# Altium project CHESSOBC_rev1.PrjPcb (part 1 of 2)
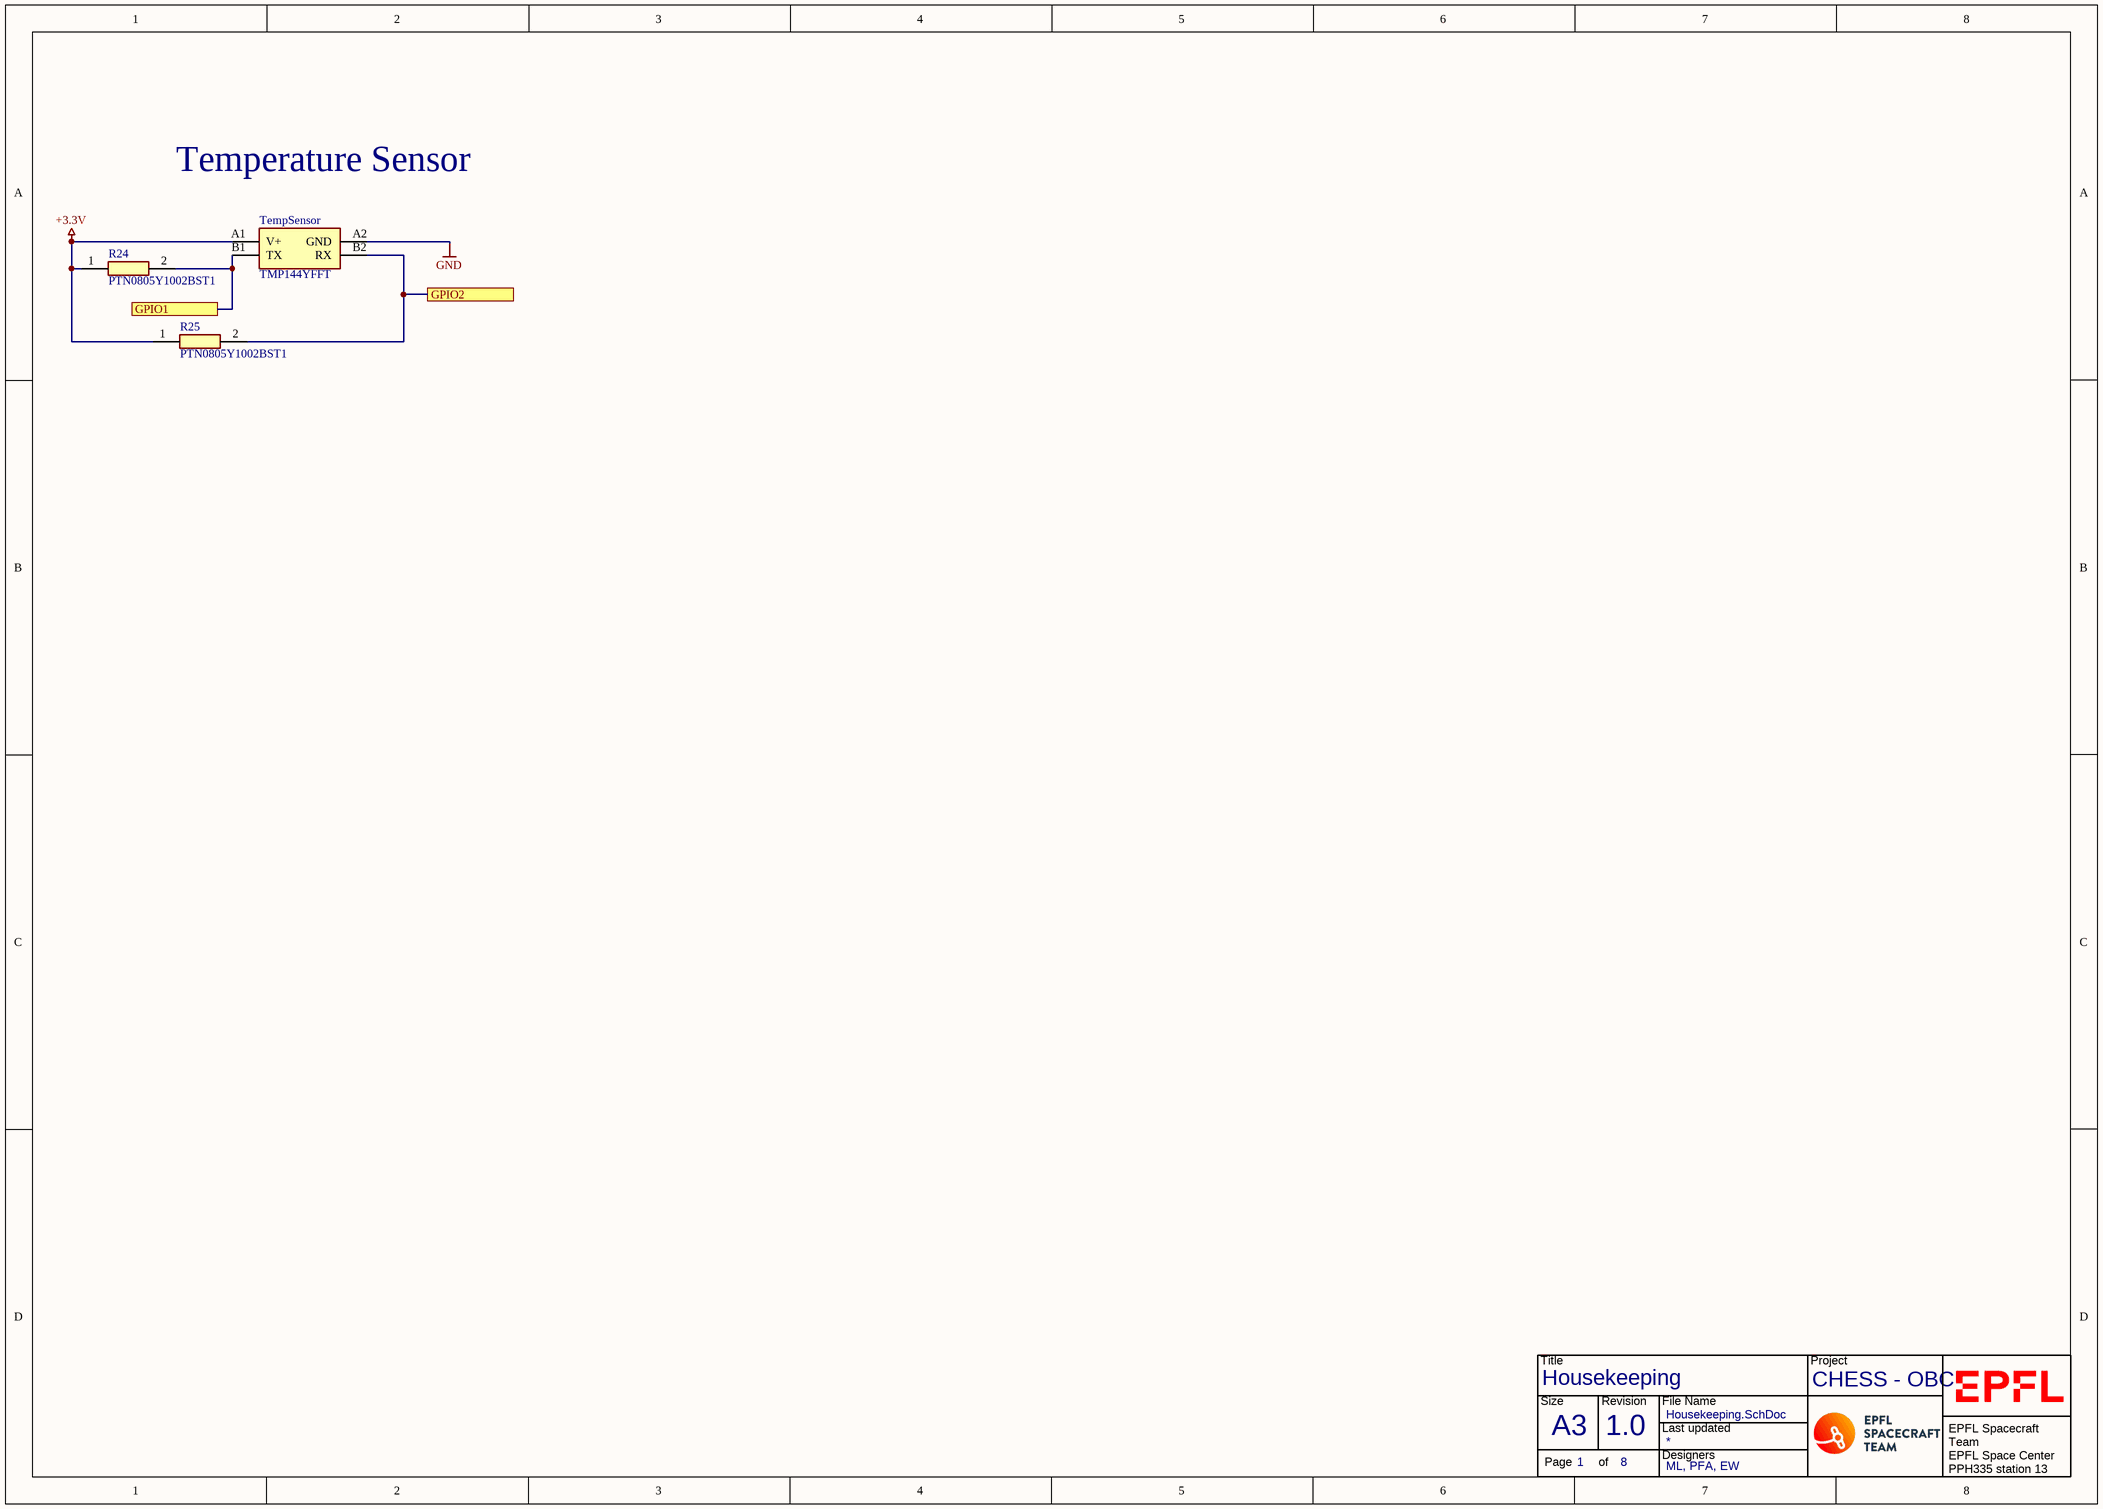
[diagram p0: Housekeeping.SchDoc]
Designers: ML, PFA, EW; Project: CHESS - OBC
8 sheets, 154 parts. Net scope: flat (ports and power ports of the same name join across sheets).
Board file: CHESSOBC_rev1.PcbDoc
Sheets:
  Housekeeping.SchDoc
  Memory.SchDoc
  Interface.SchDoc
  Power.SchDoc
  FPGAPower.SchDoc
  FPGABanks.SchDoc
  FPGAMisc.SchDoc
  GPIO_Headers.SchDoc

## Sheet Housekeeping.SchDoc: Housekeeping
size A3; PageSetup: Record=PageOptions|CenterHorizontal=True|CenterVertical=True|PrintScale=1.00|XCorrection=1.00|YCorrection=1.00|PrintKind=1|BorderSize=5000000|LeftOffset=0|BottomOffset=0|Orientation=2|PaperLength=1000|PaperWidth=1000|Scale=100|PaperSource=15|PrintQuality=1200|MediaType=1|DitherType=10|PrintScaleMode=1|PaperKind=A4|PaperIndex=9; Organization: Altium Limited; Address1: L3, 12a Rodborough Rd; Address2: Frenchs Forest; Address3: NSW; Address4: Australia 2086; DocumentNumber: 1; Revision: 1.0; SheetNumber: 1; SheetTotal: 8; SheetSize: A3

### Parts
(Parts that share a designator on the sheet are numbered #1, #2 ... from top to bottom, then left to right.)
*#1  TitleBlock  (value not drawn)  (graphical)
R24  PTN0805Y1002BST1  [RESC2013X84N]
R25  PTN0805Y1002BST1  [RESC2013X84N]
TempSensor  TMP144YFFT  [TMP144YFFT]

### Ports
GPIO1, GPIO2

### Nets
+3.3V: R24.1 R25.1 TempSensor.A1(V+)
GND: TempSensor.A2(GND)
NetP_GPIO_1: R24.2 TempSensor.B1(TX) ; port GPIO1
NetP_GPIO_2: R25.2 TempSensor.B2(RX) ; port GPIO2

### Notes on the sheet
- Temperature Sensor
- Title
- Size:
- Date:
- A3
- Number:
- Time:
- Revision:
- Sheet
- of
- File:
- (in symbol TitleBlock) Title; Project; Size; Revision; File Name; Last updated; Designers; Page; of; EPFL Spacecraft Team / EPFL Space Center / PPH335 station 13 / CH-1015 Lausanne

### Library data of the parts
*#1 = TitleBlock: Title Block with generall information
R24 R25 = PTN0805Y1002BST1: Resistor; Manufacturer_Name: Vishay; Datasheet Link: https://www.mouser.co.uk/datasheet/2/427/ptn-1763593.pdf; Height: 0.838mm; Manufacturer_Part_Number: PTN0805Y1002BST1
TempSensor = TMP144YFFT: Integrated Circuit; Manufacturer_Name: Texas Instruments; Datasheet Link: http://www.ti.com/lit/ds/symlink/tmp144.pdf; Height: 0.625mm; Manufacturer_Part_Number: TMP144YFFT

## Sheet Memory.SchDoc: Core
size A3; PageSetup: Record=PageOptions|CenterHorizontal=True|CenterVertical=True|PrintScale=1.00|XCorrection=1.00|YCorrection=1.00|PrintKind=1|BorderSize=5000000|LeftOffset=0|BottomOffset=0|Orientation=2|PaperLength=1000|PaperWidth=1000|Scale=100|PaperSource=15|PrintQuality=1200|MediaType=1|DitherType=10|PrintScaleMode=1|PaperKind=A4|PaperIndex=9; Organization: Altium Limited; Address1: L3, 12a Rodborough Rd; Address2: Frenchs Forest; Address3: NSW; Address4: Australia 2086; DocumentNumber: 2; Revision: 1.0; SheetNumber: 2; SheetTotal: 8; SheetSize: A3
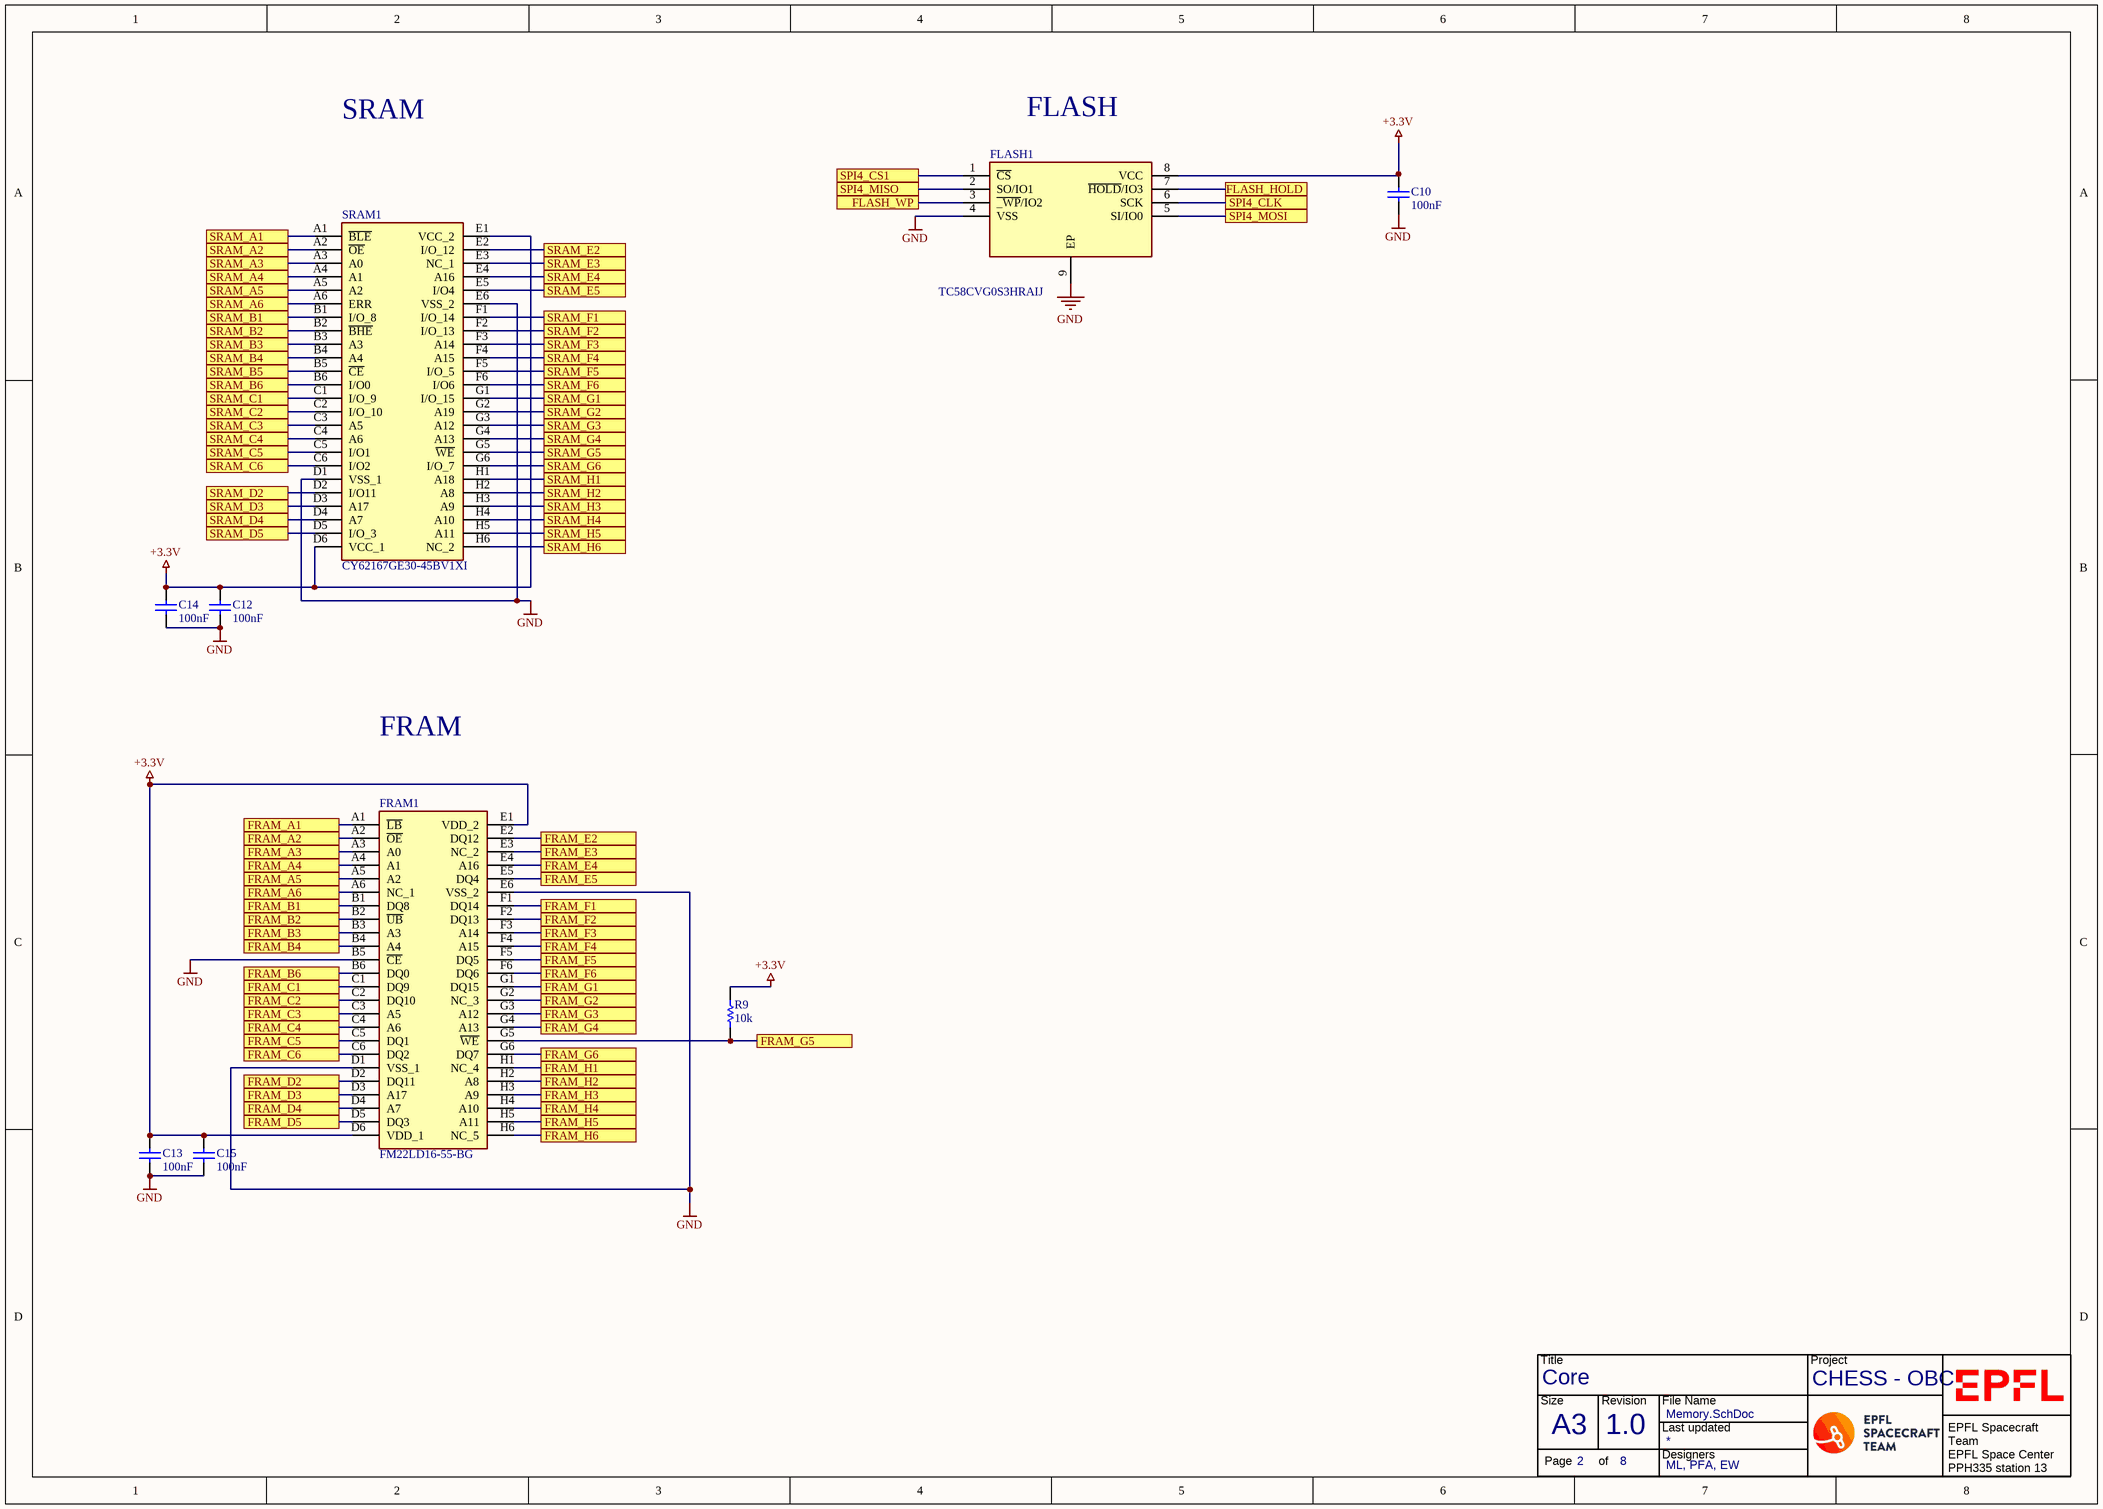
[diagram p1: Memory.SchDoc]

### Parts
(Parts that share a designator on the sheet are numbered #1, #2 ... from top to bottom, then left to right.)
*#2  TitleBlock  (value not drawn)  (graphical)
C10  100nF  [CAPC1005X60X30ML05T10]
C12  100nF  [CAPC1005X60X30ML05T10]
C13  100nF  [CAPC1005X60X30ML05T10]
C14  100nF  [CAPC1005X60X30ML05T10]
C15  100nF  [CAPC1005X60X30ML05T10]
FLASH1  TC58CVG0S3HRAIJ  [SON127P800X600X80-9N-D]
FRAM1  FM22LD16-55-BG  [BGA48C75P6X8_600X800X120]
R9  10k  [RESC1005X40X25LL05T10]
SRAM1  CY62167GE30-45BV1XI  [BGA48C75P6X8_600X800X100]

### Ports
FLASH_HOLD, FLASH_WP, FRAM_A1, FRAM_A2, FRAM_A3, FRAM_A4, FRAM_A5, FRAM_A6, FRAM_B1, FRAM_B2, FRAM_B3, FRAM_B4, FRAM_B6, FRAM_C1, FRAM_C2, FRAM_C3, FRAM_C4, FRAM_C5, FRAM_C6, FRAM_D2, FRAM_D3, FRAM_D4, FRAM_D5, FRAM_E2, FRAM_E3, FRAM_E4, FRAM_E5, FRAM_F1, FRAM_F2, FRAM_F3, FRAM_F4, FRAM_F5, FRAM_F6, FRAM_G1, FRAM_G2, FRAM_G3, FRAM_G4, FRAM_G5, FRAM_G6, FRAM_H1, FRAM_H2, FRAM_H3, FRAM_H4, FRAM_H5, FRAM_H6, SPI4_CLK, SPI4_CS1, SPI4_MISO, SPI4_MOSI, SRAM_A1, SRAM_A2, SRAM_A3, SRAM_A4, SRAM_A5, SRAM_A6, SRAM_B1, SRAM_B2, SRAM_B3, SRAM_B4, SRAM_B5, SRAM_B6, SRAM_C1, SRAM_C2, SRAM_C3, SRAM_C4, SRAM_C5, SRAM_C6, SRAM_D2, SRAM_D3, SRAM_D4, SRAM_D5, SRAM_E2, SRAM_E3, SRAM_E4, SRAM_E5, SRAM_F1, SRAM_F2, SRAM_F3, SRAM_F4, SRAM_F5, SRAM_F6, SRAM_G1, SRAM_G2, SRAM_G3, SRAM_G4, SRAM_G5, SRAM_G6, SRAM_H1, SRAM_H2, SRAM_H3, SRAM_H4, SRAM_H5, SRAM_H6

### Nets
+3.3V: C10.2 C12.2 C13.2 C14.2 C15.2 FLASH1.8(VCC) FRAM1.D6(VDD_1) FRAM1.E1(VDD_2) R9.2 SRAM1.D6(VCC_1) SRAM1.E1(VCC_2)
GND: C10.1 C12.1 C13.1 C14.1 C15.1 FLASH1.4(VSS) FLASH1.9(EP) FRAM1.B5(~{CE}) FRAM1.D1(VSS_1) FRAM1.E6(VSS_2) SRAM1.D1(VSS_1) SRAM1.E6(VSS_2)
NetCOM_Header_14: FLASH1.6(SCK) ; port SPI4_CLK
NetFLASH1_1: FLASH1.1(~{CS}) ; port SPI4_CS1
NetFLASH1_2: FLASH1.2(SO/IO1) ; port SPI4_MISO
NetFLASH1_3: FLASH1.3(~{_WP}/IO2) ; port FLASH_WP
NetFLASH1_5: FLASH1.5(SI/IO0) ; port SPI4_MOSI
NetFLASH1_7: FLASH1.7(~{HOLD}/IO3) ; port FLASH_HOLD
NetFRAM1_A1: FRAM1.A1(~{LB}) ; port FRAM_A1
NetFRAM1_A2: FRAM1.A2(~{OE}) ; port FRAM_A2
NetFRAM1_A3: FRAM1.A3(A0) ; port FRAM_A3
NetFRAM1_A4: FRAM1.A4(A1) ; port FRAM_A4
NetFRAM1_A5: FRAM1.A5(A2) ; port FRAM_A5
NetFRAM1_A6: FRAM1.A6(NC_1) ; port FRAM_A6
NetFRAM1_B1: FRAM1.B1(DQ8) ; port FRAM_B1
NetFRAM1_B2: FRAM1.B2(~{UB}) ; port FRAM_B2
NetFRAM1_B3: FRAM1.B3(A3) ; port FRAM_B3
NetFRAM1_B4: FRAM1.B4(A4) ; port FRAM_B4
NetFRAM1_B6: FRAM1.B6(DQ0) ; port FRAM_B6
NetFRAM1_C1: FRAM1.C1(DQ9) ; port FRAM_C1
NetFRAM1_C2: FRAM1.C2(DQ10) ; port FRAM_C2
NetFRAM1_C3: FRAM1.C3(A5) ; port FRAM_C3
NetFRAM1_C4: FRAM1.C4(A6) ; port FRAM_C4
NetFRAM1_C5: FRAM1.C5(DQ1) ; port FRAM_C5
NetFRAM1_C6: FRAM1.C6(DQ2) ; port FRAM_C6
NetFRAM1_D2: FRAM1.D2(DQ11) ; port FRAM_D2
NetFRAM1_D3: FRAM1.D3(A17) ; port FRAM_D3
NetFRAM1_D4: FRAM1.D4(A7) ; port FRAM_D4
NetFRAM1_D5: FRAM1.D5(DQ3) ; port FRAM_D5
NetFRAM1_E2: FRAM1.E2(DQ12) ; port FRAM_E2
NetFRAM1_E3: FRAM1.E3(NC_2) ; port FRAM_E3
NetFRAM1_E4: FRAM1.E4(A16) ; port FRAM_E4
NetFRAM1_E5: FRAM1.E5(DQ4) ; port FRAM_E5
NetFRAM1_F1: FRAM1.F1(DQ14) ; port FRAM_F1
NetFRAM1_F2: FRAM1.F2(DQ13) ; port FRAM_F2
NetFRAM1_F3: FRAM1.F3(A14) ; port FRAM_F3
NetFRAM1_F4: FRAM1.F4(A15) ; port FRAM_F4
NetFRAM1_F5: FRAM1.F5(DQ5) ; port FRAM_F5
NetFRAM1_F6: FRAM1.F6(DQ6) ; port FRAM_F6
NetFRAM1_G1: FRAM1.G1(DQ15) ; port FRAM_G1
NetFRAM1_G2: FRAM1.G2(NC_3) ; port FRAM_G2
NetFRAM1_G3: FRAM1.G3(A12) ; port FRAM_G3
NetFRAM1_G4: FRAM1.G4(A13) ; port FRAM_G4
NetFRAM1_G5: FRAM1.G5(~{WE}) R9.1 ; port FRAM_G5
NetFRAM1_G6: FRAM1.G6(DQ7) ; port FRAM_G6
NetFRAM1_H1: FRAM1.H1(NC_4) ; port FRAM_H1
NetFRAM1_H2: FRAM1.H2(A8) ; port FRAM_H2
NetFRAM1_H3: FRAM1.H3(A9) ; port FRAM_H3
NetFRAM1_H4: FRAM1.H4(A10) ; port FRAM_H4
NetFRAM1_H5: FRAM1.H5(A11) ; port FRAM_H5
NetFRAM1_H6: FRAM1.H6(NC_5) ; port FRAM_H6
NetSRAM1_A1: SRAM1.A1(~{BLE}) ; port SRAM_A1
NetSRAM1_A2: SRAM1.A2(~{OE}) ; port SRAM_A2
NetSRAM1_A3: SRAM1.A3(A0) ; port SRAM_A3
NetSRAM1_A4: SRAM1.A4(A1) ; port SRAM_A4
NetSRAM1_A5: SRAM1.A5(A2) ; port SRAM_A5
NetSRAM1_A6: SRAM1.A6(ERR) ; port SRAM_A6
NetSRAM1_B1: SRAM1.B1(I/O_8) ; port SRAM_B1
NetSRAM1_B2: SRAM1.B2(~{BHE}) ; port SRAM_B2
NetSRAM1_B3: SRAM1.B3(A3) ; port SRAM_B3
NetSRAM1_B4: SRAM1.B4(A4) ; port SRAM_B4
NetSRAM1_B5: SRAM1.B5(~{CE}) ; port SRAM_B5
NetSRAM1_B6: SRAM1.B6(I/O0) ; port SRAM_B6
NetSRAM1_C1: SRAM1.C1(I/O_9) ; port SRAM_C1
NetSRAM1_C2: SRAM1.C2(I/O_10) ; port SRAM_C2
NetSRAM1_C3: SRAM1.C3(A5) ; port SRAM_C3
NetSRAM1_C4: SRAM1.C4(A6) ; port SRAM_C4
NetSRAM1_C5: SRAM1.C5(I/O1) ; port SRAM_C5
NetSRAM1_C6: SRAM1.C6(I/O2) ; port SRAM_C6
NetSRAM1_D2: SRAM1.D2(I/O11) ; port SRAM_D2
NetSRAM1_D3: SRAM1.D3(A17) ; port SRAM_D3
NetSRAM1_D4: SRAM1.D4(A7) ; port SRAM_D4
NetSRAM1_D5: SRAM1.D5(I/O_3) ; port SRAM_D5
NetSRAM1_E2: SRAM1.E2(I/O_12) ; port SRAM_E2
NetSRAM1_E3: SRAM1.E3(NC_1) ; port SRAM_E3
NetSRAM1_E4: SRAM1.E4(A16) ; port SRAM_E4
NetSRAM1_E5: SRAM1.E5(I/O4) ; port SRAM_E5
NetSRAM1_F1: SRAM1.F1(I/O_14) ; port SRAM_F1
NetSRAM1_F2: SRAM1.F2(I/O_13) ; port SRAM_F2
NetSRAM1_F3: SRAM1.F3(A14) ; port SRAM_F3
NetSRAM1_F4: SRAM1.F4(A15) ; port SRAM_F4
NetSRAM1_F5: SRAM1.F5(I/O_5) ; port SRAM_F5
NetSRAM1_F6: SRAM1.F6(I/O6) ; port SRAM_F6
NetSRAM1_G1: SRAM1.G1(I/O_15) ; port SRAM_G1
NetSRAM1_G2: SRAM1.G2(A19) ; port SRAM_G2
NetSRAM1_G3: SRAM1.G3(A12) ; port SRAM_G3
NetSRAM1_G4: SRAM1.G4(A13) ; port SRAM_G4
NetSRAM1_G5: SRAM1.G5(~{WE}) ; port SRAM_G5
NetSRAM1_G6: SRAM1.G6(I/O_7) ; port SRAM_G6
NetSRAM1_H1: SRAM1.H1(A18) ; port SRAM_H1
NetSRAM1_H2: SRAM1.H2(A8) ; port SRAM_H2
NetSRAM1_H3: SRAM1.H3(A9) ; port SRAM_H3
NetSRAM1_H4: SRAM1.H4(A10) ; port SRAM_H4
NetSRAM1_H5: SRAM1.H5(A11) ; port SRAM_H5
NetSRAM1_H6: SRAM1.H6(NC_2) ; port SRAM_H6

### Notes on the sheet
- SRAM
- (near FLASH1) FLASH
- FRAM
- Title
- Size:
- Date:
- A3
- Number:
- Time:
- Revision:
- Sheet
- of
- File:
- (in symbol TitleBlock) Title; Project; Size; Revision; File Name; Last updated; Designers; Page; of; EPFL Spacecraft Team / EPFL Space Center / PPH335 station 13 / CH-1015 Lausanne

### Library data of the parts
*#2 = TitleBlock: Title Block with generall information
C10 C12-C15 = CMP-2008-02046-1: Manufacturer: Kemet; Part Number: C0402C104K8PACTU
FLASH1 = TC58CVG0S3HRAIJ: Capacitor Polarised; Manufacturer_Name: Kioxia America; Datasheet Link: https://business.kioxia.com/en-us/memory/detail.TC58CVG0S3HRAIJ.html; Height: 0.8mm; Manufacturer_Part_Number: TC58CVG0S3HRAIJ; Mouser Part Number: 757-TC58CVG0S3HRAIJ; Mouser Price/Stock: https://www.mouser.co.uk/ProductDetail/Kioxia-America/TC58CVG0S3HRAIJ?qs=OlC7AqGiEDnRG%2Fk7X5l76A%3D%3D
FRAM1 = FM22LD16-55-BG: Integrated Circuit; Manufacturer_Name: Cypress Semiconductor; Datasheet Link: https://datasheet.datasheetarchive.com/originals/dk/DKDS-12/237922.pdf; Height: 1.2mm; Manufacturer_Part_Number: FM22LD16-55-BG; Mouser Part Number: 877-FM22LD16-55-BG; Mouser Price/Stock: https://www.mouser.com/Search/Refine.aspx?Keyword=877-FM22LD16-55-BG; Arrow Part Number: FM22LD16-55-BG; Arrow Price/Stock: https://www.arrow.com/en/products/fm22ld16-55-bg/cypress-semiconductor
R9 = CMP-2002-07353-1: Part Number: RC0402FR-0710KL; Manufacturer: Yageo / Phycomp
SRAM1 = CY62167GE30-45BV1XI: Integrated Circuit; Manufacturer_Name: Cypress Semiconductor; Datasheet Link: https://datasheet.datasheetarchive.com/originals/dk/DKDS-12/238198.pdf; Height: 1mm; Manufacturer_Part_Number: CY62167GE30-45BV1XI; Mouser Part Number: 727-CY62167GE30BV1XI; Mouser Price/Stock: https://www.mouser.co.uk/ProductDetail/Cypress-Semiconductor/CY62167GE30-45BV1XI/?qs=3FnuM6ZipRIEqfAGSsiEJg%3D%3D; Arrow Part Number: CY62167GE30-45BV1XI; Arrow Price/Stock: https://www.arrow.com/en/products/cy62167ge30-45bv1xi/cypress-semiconductor

## Sheet Interface.SchDoc: Interface
size A3; PageSetup: Record=PageOptions|CenterHorizontal=True|CenterVertical=True|PrintScale=1.00|XCorrection=1.00|YCorrection=1.00|PrintKind=1|BorderSize=5000000|LeftOffset=0|BottomOffset=0|Orientation=2|PaperLength=1000|PaperWidth=1000|Scale=100|PaperSource=15|PrintQuality=1200|MediaType=1|DitherType=10|PrintScaleMode=1|PaperKind=A4|PaperIndex=9; Organization: Altium Limited; Address1: L3, 12a Rodborough Rd; Address2: Frenchs Forest; Address3: NSW; Address4: Australia 2086; DocumentNumber: 3; Revision: 1.0; SheetNumber: 3; SheetTotal: 8; SheetSize: A3
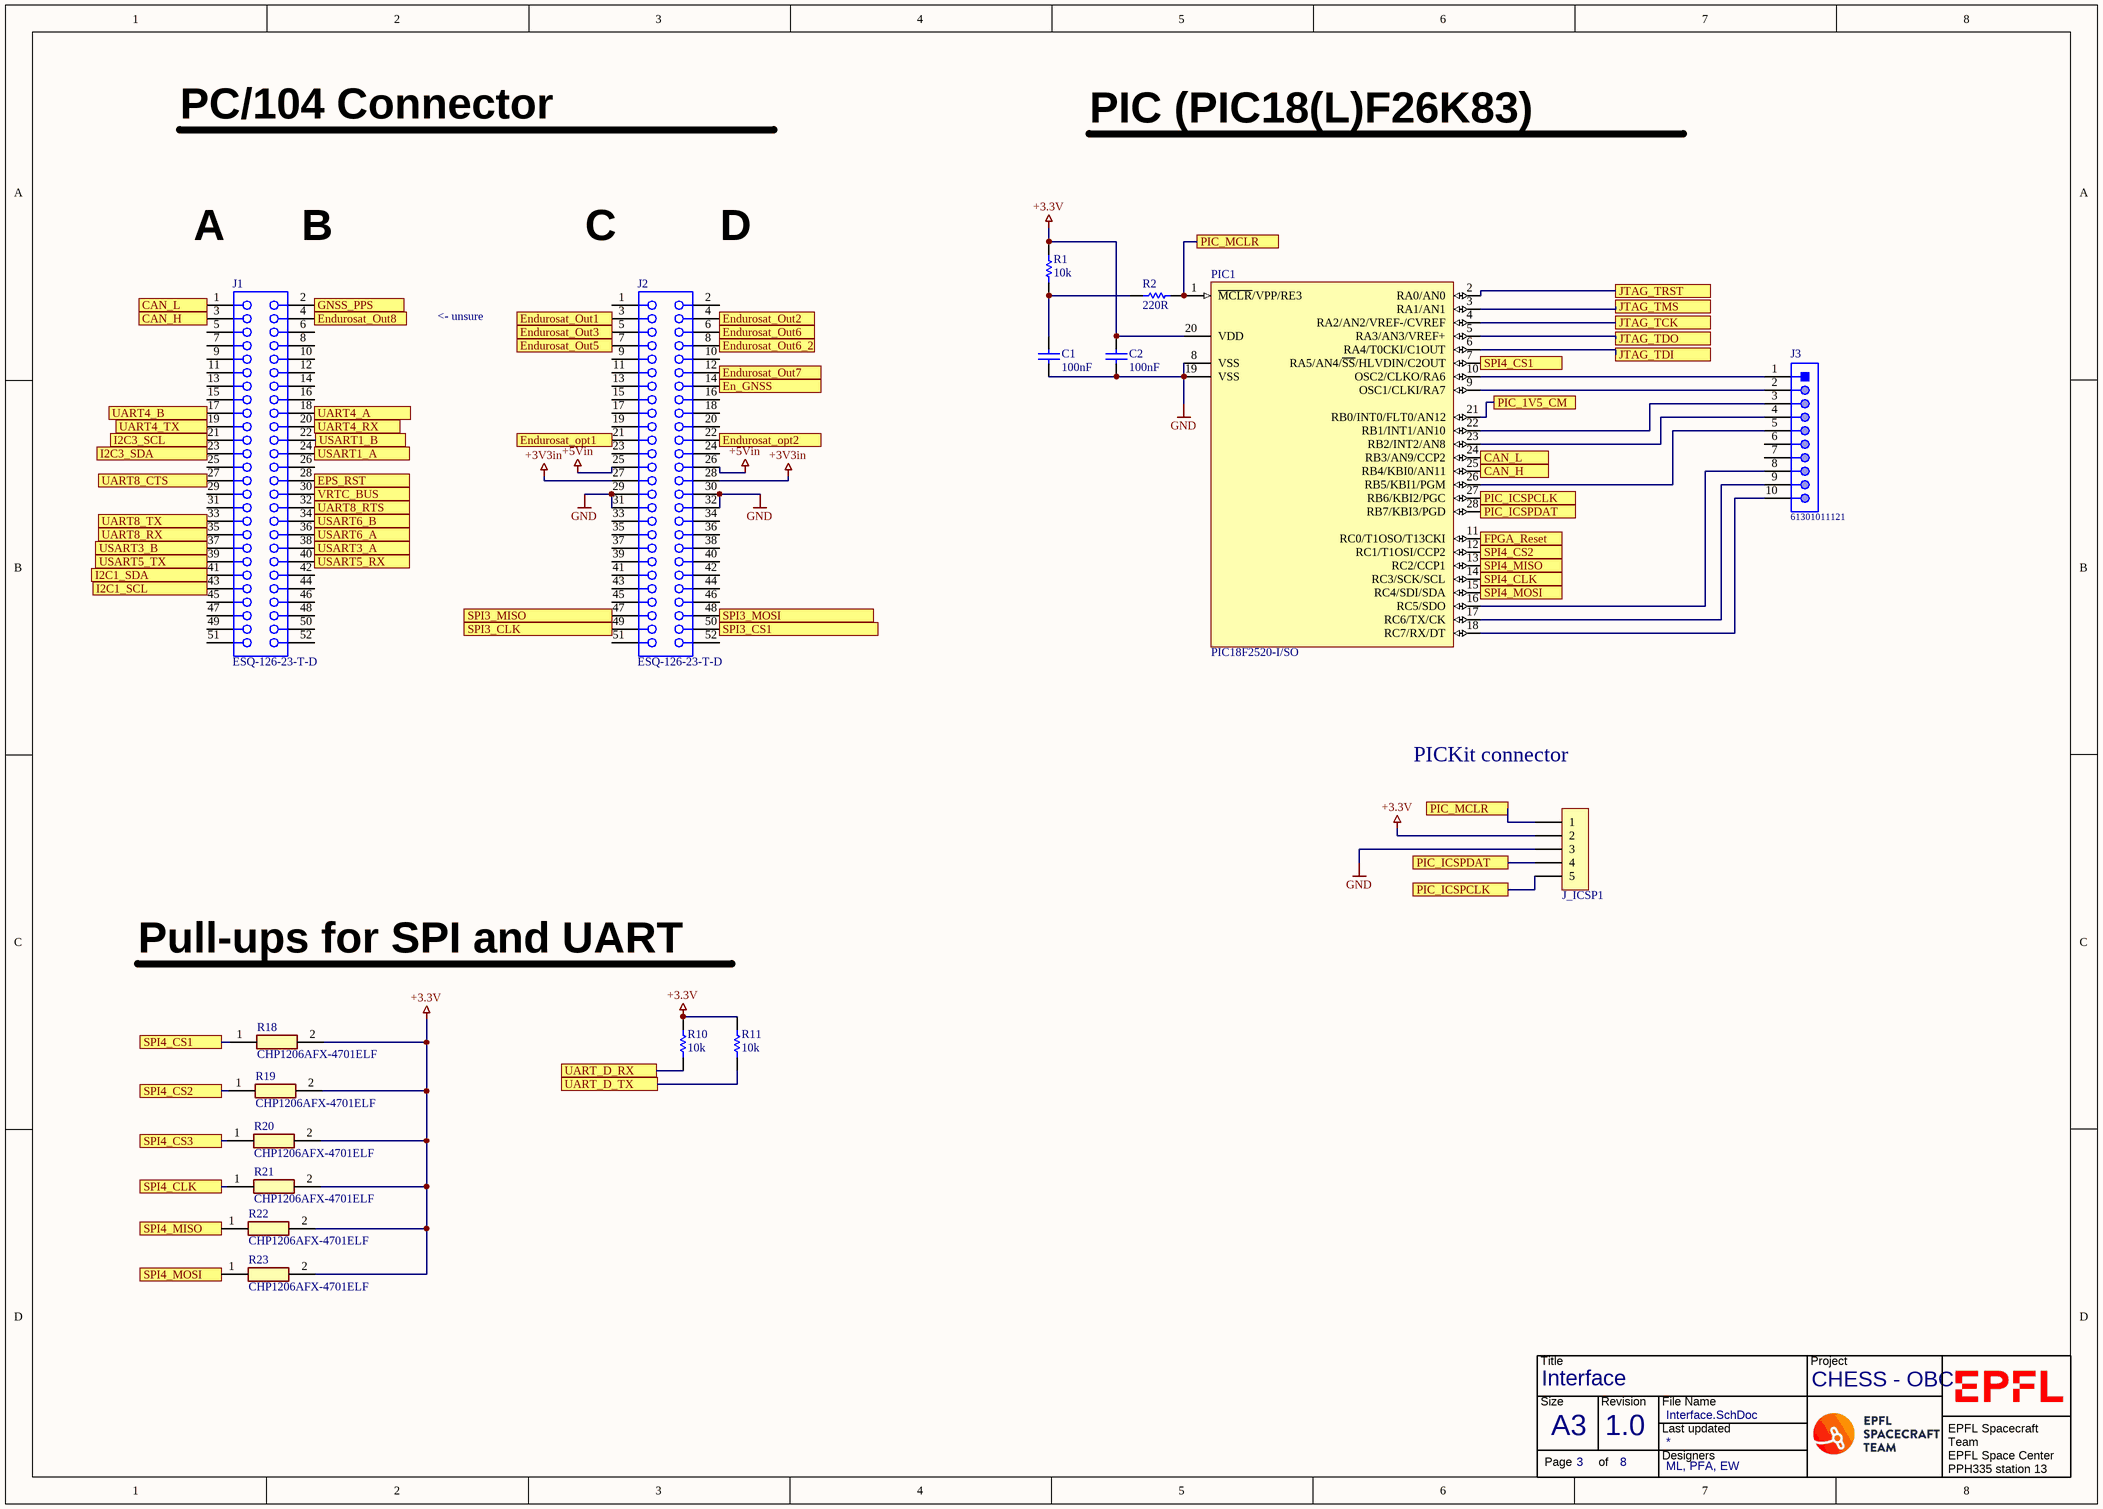
[diagram p2: Interface.SchDoc]

### Parts
(Parts that share a designator on the sheet are numbered #1, #2 ... from top to bottom, then left to right.)
*#3  TitleBlock  (value not drawn)  (graphical)
C1  100nF  [CAPC1005X60X30ML05T10]
C2  100nF  [CAPC1005X60X30ML05T10]
J1  ESQ-126-23-T-D  [SMTC-ESQ-126-23-X-D]
J2  ESQ-126-23-T-D  [SMTC-ESQ-126-23-X-D]
J3  61301011121  [61301011121]
J_ICSP1  *  [HDR1X5]  (value not drawn)
PIC1  PIC18F2520-I/SO  [SOIC-SO28_L]
R1  10k  [RESC1005X40X25LL05T10]
R2  220R  [RESC1005X40X25ML05T10]
R10  10k  [RESC1005X40X25LL05T10]
R11  10k  [RESC1005X40X25LL05T10]
R18  CHP1206AFX-4701ELF  [RESC3116X65N]
R19  CHP1206AFX-4701ELF  [RESC3116X65N]
R20  CHP1206AFX-4701ELF  [RESC3116X65N]
R21  CHP1206AFX-4701ELF  [RESC3116X65N]
R22  CHP1206AFX-4701ELF  [RESC3116X65N]
R23  CHP1206AFX-4701ELF  [RESC3116X65N]

### Ports
CAN_H, CAN_L, En_GNSS, Endurosat_opt1, Endurosat_opt2, Endurosat_Out1, Endurosat_Out2, Endurosat_Out3, Endurosat_Out5, Endurosat_Out6, Endurosat_Out6_2, Endurosat_Out7, Endurosat_Out8, EPS_RST, FPGA_Reset, GNSS_PPS, I2C1_SCL, I2C1_SDA, I2C3_SCL, I2C3_SDA, JTAG_TCK, JTAG_TDI, JTAG_TDO, JTAG_TMS, JTAG_TRST, PIC_1V5_CM, PIC_ICSPCLK, PIC_ICSPDAT, PIC_MCLR, SPI3_CLK, SPI3_CS1, SPI3_MISO, SPI3_MOSI, SPI4_CLK, SPI4_CS1, SPI4_CS2, SPI4_CS3, SPI4_MISO, SPI4_MOSI, UART4_A, UART4_B, UART4_RX, UART4_TX, UART8_CTS, UART8_RTS, UART8_RX, UART8_TX, UART_D_RX, UART_D_TX, USART1_A, USART1_B, USART3_A, USART3_B, USART5_RX, USART5_TX, USART6_A, USART6_B, VRTC_BUS

### Nets
+3.3V: C2.2 J2.27 J2.28 J_ICSP1.2 PIC1.20(VDD) R1.2 R10.2 R11.2 R18.2 R19.2 R20.2 R21.2 R22.2 R23.2  [also labelled +3V3in]
+5Vin: J2.25 J2.26
GND: C1.1 C2.1 J2.29 J2.30 J2.31 J2.32 J_ICSP1.3 PIC1.8(VSS) PIC1.19(VSS)
NetC1_2: C1.2 R1.1 R2.1
NetC58_2: PIC1.21(RB0/INT0/FLT0/AN12) ; port PIC_1V5_CM
NetCOM_Header_14: PIC1.14(RC3/SCK/SCL) R21.1 ; port SPI4_CLK
NetCOM_Header_16: R20.1 ; port SPI4_CS3
NetCOM_Header_19: R10.1 ; port UART_D_RX
NetCOM_Header_20: R11.1 ; port UART_D_TX
NetFLASH1_1: PIC1.7(RA5/AN4/~{SS}/HLVDIN/C2OUT) R18.1 ; port SPI4_CS1
NetFLASH1_2: PIC1.13(RC2/CCP1) R22.1 ; port SPI4_MISO
NetFLASH1_5: PIC1.15(RC4/SDI/SDA) R23.1 ; port SPI4_MOSI
NetJ1_1: J1.1 PIC1.24(RB3/AN9/CCP2) ; port CAN_L
NetJ1_2: J1.2 ; port GNSS_PPS
NetJ1_3: J1.3 PIC1.25(RB4/KBI0/AN11) ; port CAN_H
NetJ1_4: J1.4 ; port Endurosat_Out8
NetJ1_17: J1.17 ; port UART4_B
NetJ1_18: J1.18 ; port UART4_A
NetJ1_19: J1.19 ; port UART4_TX
NetJ1_20: J1.20 ; port UART4_RX
NetJ1_21: J1.21 ; port I2C3_SCL
NetJ1_22: J1.22 ; port USART1_B
NetJ1_23: J1.23 ; port I2C3_SDA
NetJ1_24: J1.24 ; port USART1_A
NetJ1_27: J1.27 ; port UART8_CTS
NetJ1_28: J1.28 ; port EPS_RST
NetJ1_30: J1.30 ; port VRTC_BUS
NetJ1_32: J1.32 ; port UART8_RTS
NetJ1_33: J1.33 ; port UART8_TX
NetJ1_34: J1.34 ; port USART6_B
NetJ1_35: J1.35 ; port UART8_RX
NetJ1_36: J1.36 ; port USART6_A
NetJ1_37: J1.37 ; port USART3_B
NetJ1_38: J1.38 ; port USART3_A
NetJ1_39: J1.39 ; port USART5_TX
NetJ1_40: J1.40 ; port USART5_RX
NetJ1_41: J1.41 ; port I2C1_SDA
NetJ1_43: J1.43 ; port I2C1_SCL
NetJ2_3: J2.3 ; port Endurosat_Out1
NetJ2_4: J2.4 ; port Endurosat_Out2
NetJ2_5: J2.5 ; port Endurosat_Out3
NetJ2_6: J2.6 ; port Endurosat_Out6
NetJ2_7: J2.7 ; port Endurosat_Out5
NetJ2_8: J2.8 ; port Endurosat_Out6_2
NetJ2_12: J2.12 ; port Endurosat_Out7
NetJ2_14: J2.14 ; port En_GNSS
NetJ2_21: J2.21 ; port Endurosat_opt1
NetJ2_22: J2.22 ; port Endurosat_opt2
NetJ2_47: J2.47 ; port SPI3_MISO
NetJ2_48: J2.48 ; port SPI3_MOSI
NetJ2_49: J2.49 ; port SPI3_CLK
NetJ2_50: J2.50 ; port SPI3_CS1
NetJ3_1: J3.1 PIC1.10(OSC2/CLKO/RA6)
NetJ3_2: J3.2 PIC1.9(OSC1/CLKI/RA7)
NetJ3_3: J3.3 PIC1.22(RB1/INT1/AN10)
NetJ3_4: J3.4 PIC1.23(RB2/INT2/AN8)
NetJ3_5: J3.5 PIC1.26(RB5/KBI1/PGM)
NetJ3_8: J3.8 PIC1.16(RC5/SDO)
NetJ3_9: J3.9 PIC1.17(RC6/TX/CK)
NetJ3_10: J3.10 PIC1.18(RC7/RX/DT)
NetJ_ICSP1_1: J_ICSP1.1 PIC1.1(~{MCLR}/VPP/RE3) R2.2 ; port PIC_MCLR
NetJ_ICSP1_4: J_ICSP1.4 PIC1.28(RB7/KBI3/PGD) ; port PIC_ICSPDAT
NetJ_ICSP1_5: J_ICSP1.5 PIC1.27(RB6/KBI2/PGC) ; port PIC_ICSPCLK
NetPIC1_2: PIC1.2(RA0/AN0) ; port JTAG_TRST
NetPIC1_3: PIC1.3(RA1/AN1) ; port JTAG_TMS
NetPIC1_4: PIC1.4(RA2/AN2/VREF-/CVREF) ; port JTAG_TCK
NetPIC1_5: PIC1.5(RA3/AN3/VREF+) ; port JTAG_TDO
NetPIC1_6: PIC1.6(RA4/T0CKI/C1OUT) ; port JTAG_TDI
NetPIC1_11: PIC1.11(RC0/T1OSO/T13CKI) ; port FPGA_Reset
NetPIC1_12: PIC1.12(RC1/T1OSI/CCP2) R19.1 ; port SPI4_CS2

Not connected (* = marked no-connect by the designer): J1 5 6 7 8 9 10 11 12 13 14 15 16 25 26 29 31 42 44 45 46 47 48 49 50 51 52; J2 1 2 9 10 11 13 15 16 17 18 19 20 23 24 33 34 35 36 37 38 39 40 41 42 43 44 45 46 51 52; J3 6 7

### Notes on the sheet
- PC/104 Connector
- PIC (PIC18(L)F26K83)
- A
- B
- C
- D
- <- unsure
- PICKit connector
- Pull-ups for SPI and UART
- Title
- Size:
- Date:
- A3
- Number:
- Time:
- Revision:
- Sheet
- of
- File:
- (in symbol TitleBlock) Title; Project; Size; Revision; File Name; Last updated; Designers; Page; of; EPFL Spacecraft Team / EPFL Space Center / PPH335 station 13 / CH-1015 Lausanne

### Library data of the parts
*#3 = TitleBlock: Title Block with generall information
C1 C2 = CMP-2008-02046-1: as C10 on sheet Memory
J1 J2 = CMP-1026-00047-1: PC/104(TM) Elevated Socket Strip, Through-hole, Vertical, -55 to 105 degC, 2.54 mm Pitch, 52-Pin, Female, RoHS; Manufacturer: Samtec; Pitch: 2.54 mm; ComponentLink1Description: Manufacturer URL; RoHS: True; PartNumber: ESQ-126-23-T-D; DatasheetVersion: F-214; ComponentLink3Description: Package Specification; Orientation: Vertical; Temperature Range: -55 to 105 degC; ComponentLink1URL: http://www.samtec.com; ComponentLink3URL: http://www.samtec.com/documents/webfiles/cpdf/ESQ-1XX-XX-X-X-XXX-XX-X-XX-MKT.pdf; PackageReference: ESQ-126-23-X-D; Mounting Technology: Through-hole; PackageDescription: ESQ Strip ASM; ComponentLink2Description: Datasheet; PackageVersion: BZ, 9/1998; ComponentLink2URL: http://www.samtec.com/documents/webfiles/pdf/ESQ_TH.PDF
J3 = CMP-1502-01082-1: THT Vertical Pin Header WR-PHD, Pitch 2.54 mm, Single Row, 10 pins; Manufacturer: Wurth Elektronik; Contact Resistance: 20mOhm; Rated Current: 3A; Pitch: 2.54mm; Gender: Male; Pin Number: 10; Working Voltage: 250VAC; Withstanding Voltage: 500VAC; Manufacturer URL: http://www.we-online.de; Operating Temperature: -40to105degC; Datasheet URL: https://katalog.we-online.de/em/datasheet/6130xx11121.pdf; Row Number: Single; Orientation: Vertical; Part Number: 61301011121; Packaging: Bag; Package Reference: 61301011121; Mounting Technology: THT; Publisher: WurthElektronik
J_ICSP1 = PinHeader1x5: Plug connector; Value: *
PIC1 = CMP-0116-01078-1: Enhanced Flash Microcontroller with 10-Bit A/D and nanoWatt Technology, 32K Flash, 28-Pin SOIC, Industrial Temperature Range; Code_JEDEC: MS-013; PackageReference: SOIC-SO28; PackageVersion: revBB, Aug-2009; DatasheetVersion: revE, Oct-2008; PackageDescription: 28-Lead Plastic Small Outline (SO) - Wide 7.50mm Body [SOIC]
R1 R10 R11 = CMP-2002-07353-1: as R9 on sheet Memory
R2 = CMP-2002-07511-1: Part Number: RC0402FR-07220RL; Manufacturer: Yageo / Phycomp
R18-R23 = CHP1206AFX-4701ELF: Resistor; Manufacturer_Name: Bourns; Datasheet Link: https://www.mouser.be/datasheet/2/54/chp-a-1858677.pdf; Height: 0.65mm; Manufacturer_Part_Number: CHP1206AFX-4701ELF

## Sheet Power.SchDoc: Power and mechanical
size A3; Organization: Altium Limited; Address1: L3, 12a Rodborough Rd; Address2: Frenchs Forest; Address3: NSW; Address4: Australia 2086; DocumentNumber: 4; Revision: 1.0; SheetNumber: 4; SheetTotal: 8; SheetSize: A3
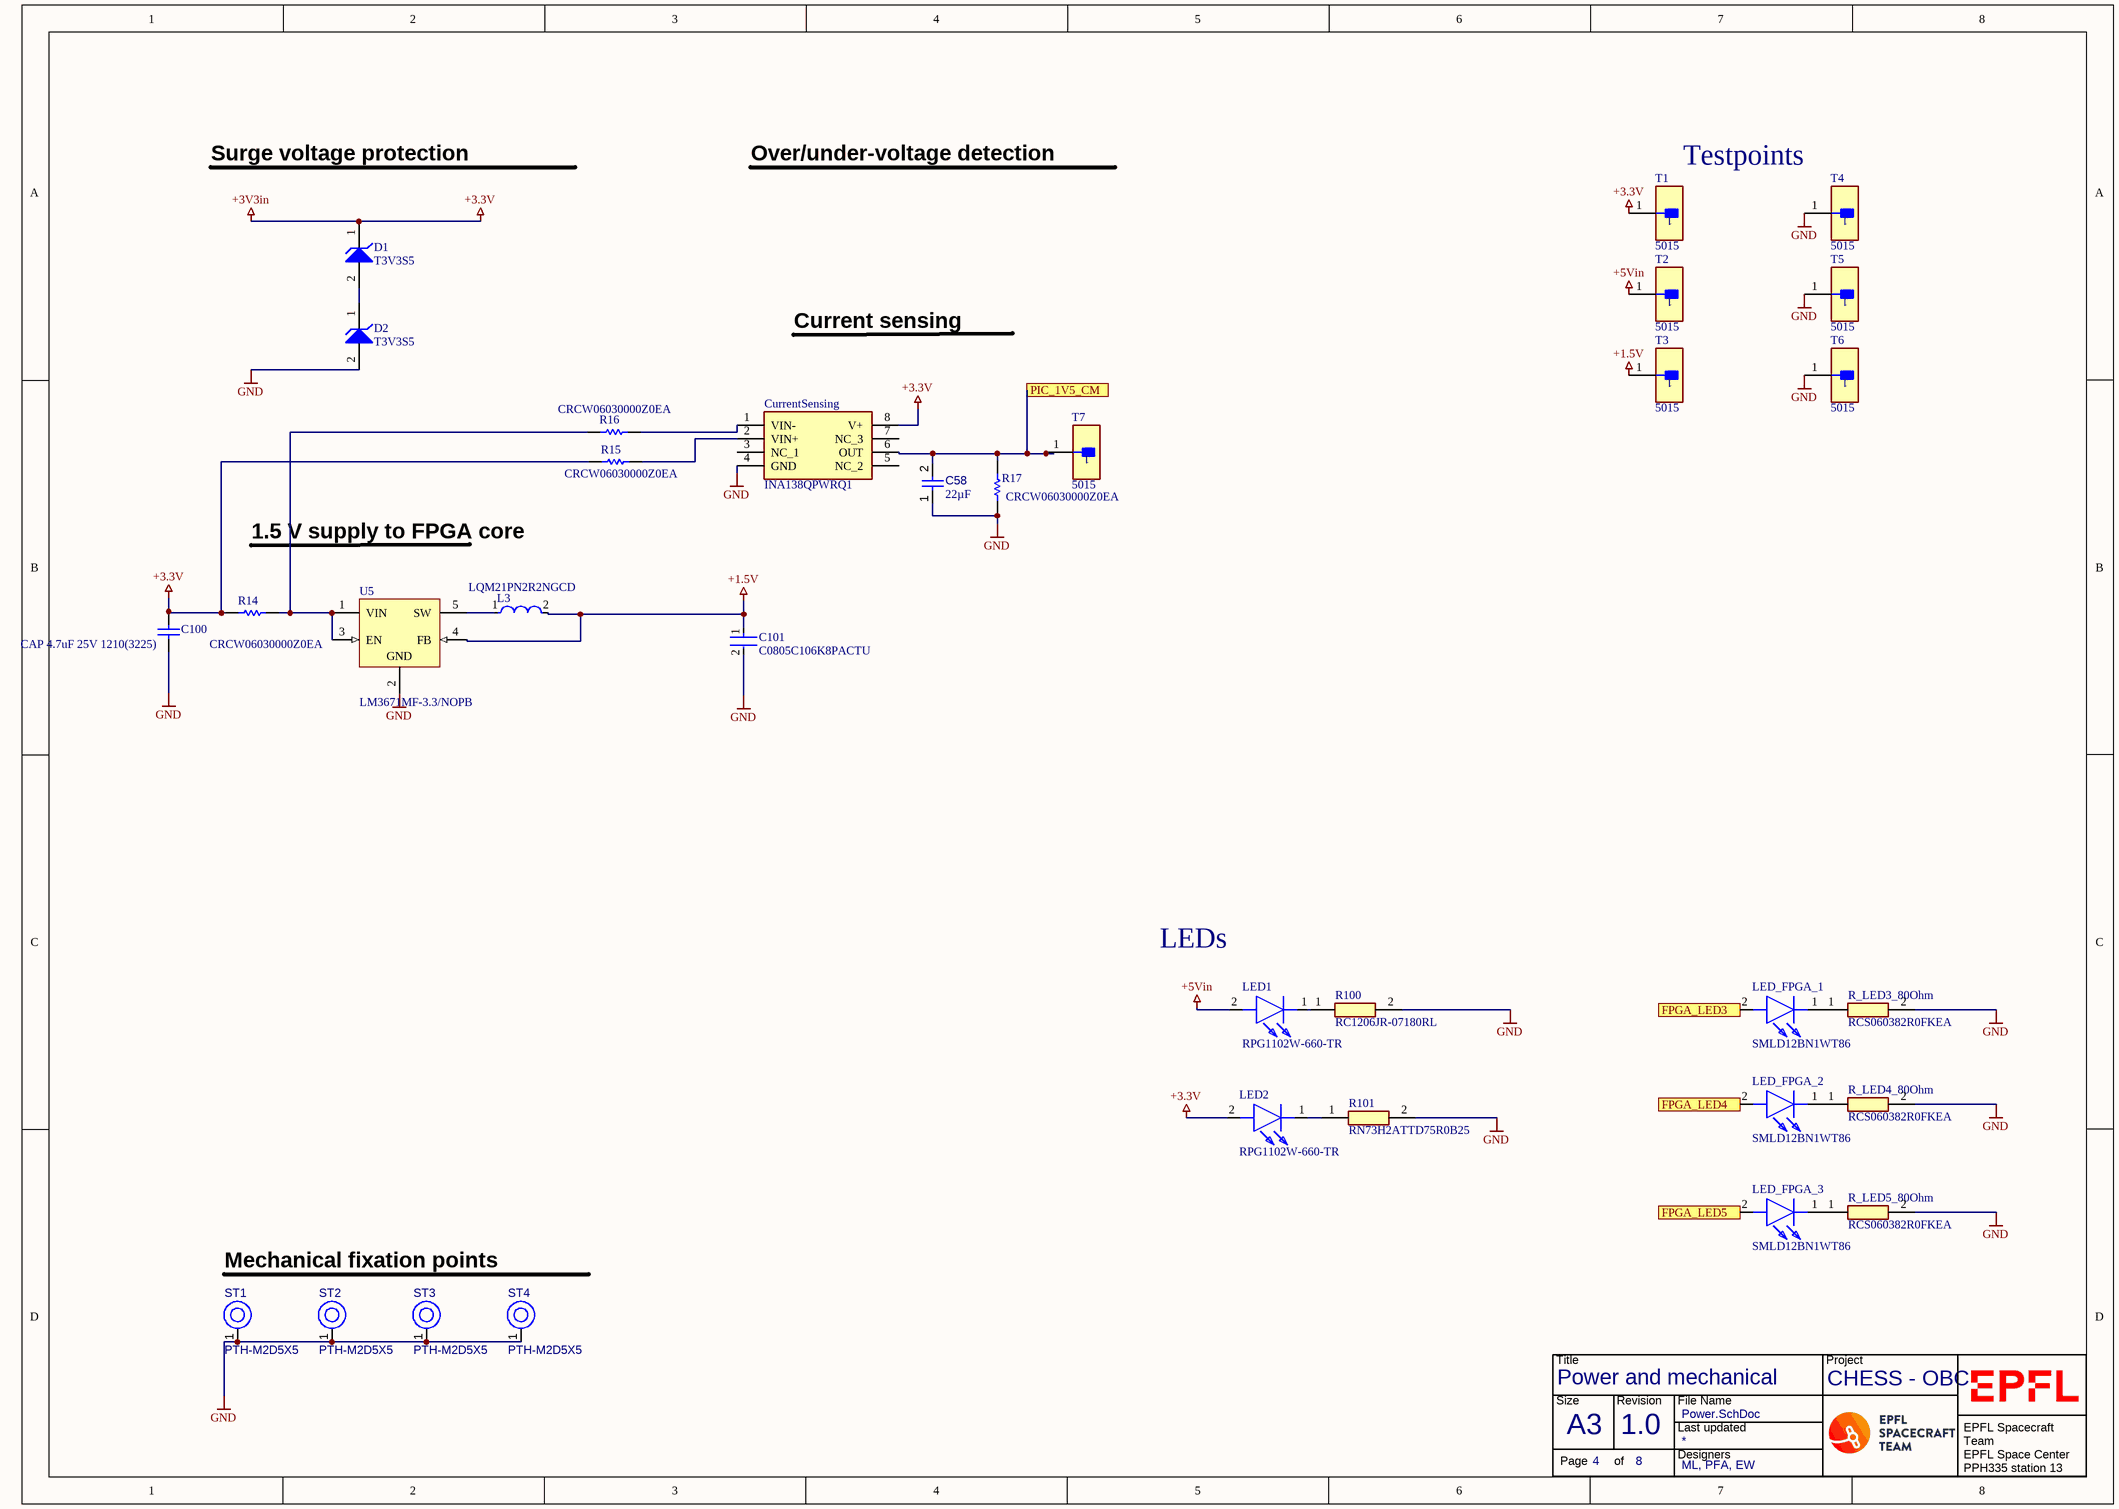
[diagram p3: Power.SchDoc]

### Parts
(Parts that share a designator on the sheet are numbered #1, #2 ... from top to bottom, then left to right.)
*#4  TitleBlock  (value not drawn)  (graphical)
C58  value 22µF  [CAPC0805(2012)145_L]  (hidden comment: Capacitor 22µF +/-40% 16V 0805)
C100  CAP 4.7uF 25V 1210(3225)  [CAPC1210(3225)220_M]
C101  C0805C106K8PACTU  [FP-C0805C-DG-MFG]
CurrentSensing  INA138QPWRQ1  [SOP65P640X120-8N]
D1  T3V3S5  [ONSC-SOD-523-2-502-01_V]
D2  T3V3S5  [ONSC-SOD-523-2-502-01_V]
L3  LQM21PN2R2NGCD  [FP-LQM21PH_G0-IPC_C]
LED1  RPG1102W-660-TR  [LEDC3015X190N]
LED2  RPG1102W-660-TR  [LEDC3015X190N]
LED_FPGA_1  SMLD12BN1WT86  [LEDM168X65N]
LED_FPGA_2  SMLD12BN1WT86  [LEDM168X65N]
LED_FPGA_3  SMLD12BN1WT86  [LEDM168X65N]
R14  CRCW06030000Z0EA  [RESC1609X50X30NL8T20]
R15  CRCW06030000Z0EA  [RESC1609X50X30NL8T20]
R16  CRCW06030000Z0EA  [RESC1609X50X30NL8T20]
R17  CRCW06030000Z0EA  [RESC1609X50X30NL8T20]
R100  RC1206JR-07180RL  [RESC3116X65N]
R101  RN73H2ATTD75R0B25  [RESC2012X60N]
R_LED3_80Ohm  RCS060382R0FKEA  [RESC1608X50N]
R_LED4_80Ohm  RCS060382R0FKEA  [RESC1608X50N]
R_LED5_80Ohm  RCS060382R0FKEA  [RESC1608X50N]
ST1  PTH-M2D5X5  [PTH-M2D5X5]
ST2  PTH-M2D5X5  [PTH-M2D5X5]
ST3  PTH-M2D5X5  [PTH-M2D5X5]
ST4  PTH-M2D5X5  [PTH-M2D5X5]
T1  5015  [FP-5015-MFG]
T2  5015  [FP-5015-MFG]
T3  5015  [FP-5015-MFG]
T4  5015  [FP-5015-MFG]
T5  5015  [FP-5015-MFG]
T6  5015  [FP-5015-MFG]
T7  5015  [FP-5015-MFG]
U5  LM3671MF-3.3/NOPB  [DBV0005A_N]

### Ports
FPGA_LED3, FPGA_LED4, FPGA_LED5, PIC_1V5_CM

### Nets
+1.5V: C101.1 L3.2 T3.1 U5.4(FB)
+3.3V: C100.2 CurrentSensing.8(V+) D1.1(K) LED2.2(A) R14.1 R15.1 T1.1  [also labelled +3V3in]
+5Vin: LED1.2(A) T2.1
GND: C58.1 C100.1 C101.2 CurrentSensing.4(GND) D2.2(A) R17.1 R100.2 R101.2 R_LED3_80Ohm.2 R_LED4_80Ohm.2 R_LED5_80Ohm.2 ST1.1(H1) ST2.1(H1) ST3.1(H1) ST4.1(H1) T4.1 T5.1 T6.1 U5.2(GND)
NetC58_2: C58.2 CurrentSensing.6(OUT) R17.2 T7.1 ; port PIC_1V5_CM
NetCurrentSensing_1: CurrentSensing.1(VIN-) R16.2
NetCurrentSensing_2: CurrentSensing.2(VIN+) R15.2
NetD1_2: D1.2(A) D2.1(K)
NetL3_1: L3.1 U5.5(SW)
NetLED1_1: LED1.1(K) R100.1
NetLED2_1: LED2.1(K) R101.1
NetLED_FPGA_1_1: LED_FPGA_1.1(K) R_LED3_80Ohm.1
NetLED_FPGA_1_2: LED_FPGA_1.2(A) ; port FPGA_LED3
NetLED_FPGA_2_1: LED_FPGA_2.1(K) R_LED4_80Ohm.1
NetLED_FPGA_2_2: LED_FPGA_2.2(A) ; port FPGA_LED4
NetLED_FPGA_3_1: LED_FPGA_3.1(K) R_LED5_80Ohm.1
NetLED_FPGA_3_2: LED_FPGA_3.2(A) ; port FPGA_LED5
NetR14_2: R14.2 R16.1 U5.1(VIN) U5.3(EN)

Not connected (* = marked no-connect by the designer): CurrentSensing 3(NC_1) 5(NC_2) 7(NC_3)

### Notes on the sheet
- Surge voltage protection
- Over/under-voltage detection
- Testpoints
- Current sensing
- 1.5 V supply to FPGA core
- LEDs
- Mechanical fixation points
- Title
- Size:
- Date:
- A3
- Number:
- Time:
- Revision:
- Sheet
- of
- File:
- (in symbol TitleBlock) Title; Project; Size; Revision; File Name; Last updated; Designers; Page; of; EPFL Spacecraft Team / EPFL Space Center / PPH335 station 13 / CH-1015 Lausanne

### Library data of the parts
*#4 = TitleBlock: Title Block with generall information
C58 = CMP-001-00081-2: Chip Capacitor, 22µF +/-40%, 16V, 0805, Thickness 1.45 mm; Tolerance: 5%; Min Operating Temperature: -55°C; Mounting Technology: SMT; Case/Package: 0402; Pins: 2; Voltage Rating: 16V; Max Operating Temperature: 85°C
C100 = CMP-1038-02151-2: CAP 4.7uF 25V ±10% 1210 (3225 Metric) Thickness 2.2mm SMD; Case-Metric: 3225; Case-EIA: 1210; Tolerance: Â±10%; Value: 4.7uF; Technology: SMT; Max Thickness: 2.2 mm; Rated Voltage: 25 V
C101 = CMP-2007-03243-2: CAP CER 10UF 10V X5R 0805; Manufacturer: Kemet; 3DS Part Number: 220-00001; Tolerance: 10%; Temperature Coefficient: 15%; Material: Ceramic; Device Class L2: Capacitors; Device Class L1: Passive Components; ComponentLink2URL: https://content.kemet.com/datasheets/KEM_C1006_X5R_SMD.pdf; Height: 1.4mm; Lead Free: Yes; Manufacturer Part Number: C0805C106K8PACTU; Digikey Description: CAP CER 10UF 10V X5R 0805; Octopart: https://octopart.com/c0805c106k8pactu-kemet-98697; Capacitance: 10uF; Value: 10uF; Temperature Range Low: -55°C; Temperature: -55°C to +85°C; Automotive: No; Mouser Description: CAP CER 10UF 10V X5R 0805; Ipc Land Pattern Name: CAPC200125X125; Temperature Range High: +85°C; Voltage: 10V; RoHS: TRUE; Device Class L3: Ceramic Capacitors; ComponentLink2Description: Datasheet; Voltage Rating: 10V; Package: C0805C-DG; Temperature Characteristic: X5R; Category: Cap
CurrentSensing = INA138QPWRQ1: Integrated Circuit; Manufacturer_Name: Texas Instruments; Datasheet Link: http://www.ti.com/lit/gpn/ina138-q1; Height: 1.2mm; Mouser2 Part Number: 595-INA138QPWRQ1; Mouser2 Price/Stock: https://www.mouser.com/Search/Refine.aspx?Keyword=595-INA138QPWRQ1; Manufacturer_Part_Number: INA138QPWRQ1
D1 D2 = CMP-1063-00100-1: Transient Voltage Suppressor, Micro-Packaged Diode for ESD Protection, 2-Pin SOD-523, Pb-Free, Tape and Reel; Manufacturer: On Semiconductor; PartNumber: ESD5Z7.0T1G; VRWM Max (V): 7; IR Max (uA): 0.01; Direction: Unidirectional; PPK Max (W): 200; Number of Lines: 1; V(BR) Min (V): 7.5; PackageVersion: Rev. E, 09/2010; PackageReference: SOD-523-2-502-01; ComponentLink3Description: Package Specification; ComponentLink3URL: http://www.onsemi.com/pub_link/Collateral/502-01.PDF; PackageDescription: 2-Pin SOD, Body 1.2 x 0.8 mm; Packing: Tape and Reel; RoHS: Pb-Free; Mounting Technology: Surface Mount; DatasheetVersion: Rev. 10; ComponentLink2URL: http://www.onsemi.cn/pub_link/Collateral/ESD5Z2.5T1-D.PDF; ComponentLink1Description: Manufacturer URL; ComponentLink1URL: http://www.onsemi.com/; ComponentLink2Description: Datasheet
L3 = CMP-06042-016317-1: Multilayer Type Inductor for Power Lines, 0805 (2012), 2.2μH, 30%, 0.288Ω, 0.8A; Test Frequency: 1MHz; Shielding: Shielded; Current Rating: 800mA; Self Resonant Frequency: 40MHz; Core Material: Ferrite; Inductance: 2.2uH; DC Resistance (DCR): 288mR; RoHS Compliant: Yes; REACH SVHC: No SVHC; Inductance Tolerance: 30%; Package Quantity: 4000; Military Standard: Not; Max Operating Temperature: 125°C; Radiation Hardening: No; Series: LQM; Height - Seated (Max): 0.039inch; Tolerance: 30%; Height: 0.9mm; Lead Free: Lead Free; Case Code (Metric): 2012; Packaging: Tape and Reel; Termination: SMD/SMT; Case Code (Imperial): 0805; Min Operating Temperature: -55°C; Depth: 1.4mm; Mount: Surface Mount; Length: 2mm; DC Current: 800mA; Case/Package: 0805; Max DC Current: 800mA; Width: 0.049inch
LED1 LED2 = RPG1102W-660-TR: LED; Manufacturer_Name: Stanley Electric; Height: 1.9mm; Mouser2 Part Number: 327-RPG1102W660TR; Mouser2 Price/Stock: https://www.mouser.com/Search/Refine.aspx?Keyword=327-RPG1102W660TR; Manufacturer_Part_Number: RPG1102W-660-TR
LED_FPGA_1-LED_FPGA_3 = SMLD12BN1WT86: LED; Manufacturer_Name: ROHM Semiconductor; Datasheet Link: https://www.rohm.com/datasheet/SMLD12BN1W/smld12-e; Height: 0.65mm; Manufacturer_Part_Number: SMLD12BN1WT86
R14-R17 = CMP-2000-03816-5: Chip Resistor, 0 Ohm, Jumper, 100 mW, -55 to 155 degC, 0603 (1608 Metric), RoHS, Tape and Reel; Manufacturer: Vishay Semiconductor; Voltage Rating: 75 V; Package Quantity: 5000; DatasheetVersion: 06/2012; Min Operating Temperature: -55 degC; ComponentLink1URL: http://www.vishay.com/; Mounting Technology: Surface Mount; Height: 0.45 mm; ComponentLink1Description: Manufacturer URL; REACH SVHC: Unknown; PackageReference: 0603; Packaging: Tape and Reel; Max Operating Temperature: 155 degC; Mount: Surface Mount; ComponentLink2Description: Datasheet; PackageDescription: 2-Pin Surface Mount Device, Body 1.575 x 0.85 mm; Length: 1.55 mm; ComponentLink2URL: http://www.vishay.com/docs/20035/dcrcwe3.pdf; Pins: 2; RoHSCompliant: true
R100 = RC1206JR-07180RL: Resistor; Manufacturer_Name: YAGEO (PHYCOMP); Datasheet Link: https://www.sos.sk/productdata/35/10/4/35104/RC1206.pdf; Height: 0.65mm; Manufacturer_Part_Number: RC1206JR-07180RL
R101 = RN73H2ATTD75R0B25: Resistor; Manufacturer_Name: KOA Speer; Datasheet Link: https://www.mouser.de/datasheet/2/219/RN73H-1843478.pdf; Height: 0.6mm; Manufacturer_Part_Number: RN73H2ATTD75R0B25
R_LED3_80Ohm R_LED4_80Ohm R_LED5_80Ohm = RCS060382R0FKEA: Resistor; Manufacturer_Name: Vishay; Datasheet Link: https://componentsearchengine.com//RCS060382R0FKEA.pdf; Height: 0.5mm; Mouser2 Part Number: 71-RCS060382R0FKEA; Mouser2 Price/Stock: https://www.mouser.com/Search/Refine.aspx?Keyword=71-RCS060382R0FKEA; Manufacturer_Part_Number: RCS060382R0FKEA
ST1-ST4 = CMP-00028-00004-1: M2 PTH (2.5mm), 5mm pad; Pins: 1
T1-T7 = CMP-2000-05183-2: PC TEST POINT MINIATURE; Manufacturer: keystone; Number Of Contacts: 1; Conn Orientation: Straight; Category: Conn; Manufacturer Part Number: 5015; Digikey Description: PC TEST POINT MINIATURE; Automotive: No; Lead Free: Yes; Octopart: https://octopart.com/5015-keystone-3822; ComponentLink2URL: http://www.keyelco.com/product-pdf.cfm?p=1353; Package: 5015; RoHS: TRUE; Device Class L3: unset; Device Class L2: unset; Contact Material: Silver; Device Class L1: Connectors; Height: 1.65mm; ComponentLink2Description: Datasheet
U5 = CMP-0063-01132-3: 2MHz, 600mA Step-Down DC-DC Converter, 5-pin SOT-23, Pb-Free; Manufacturer: Texas Instruments; CompType: MiscPower; PowerWise: Y; PackageTopMarking: SJEB*XTT; PackageDescription: Molded SOT-23, .115 x .063 x .040 in Body, 5 Lead, .0375 in Pitch; ComponentLink1Description: Datasheet URL; PackageReference: DBV0005A; PinCount: 5; RoHS: Y; ComponentLink1URL: http://www.ti.com/general/docs/lit/getliterature.tsp?genericPartNumber=LM3671&fileType=pdf

## Sheet FPGAPower.SchDoc: FPGA - Power
size A3; Organization: Altium Limited; Address1: L3, 12a Rodborough Rd; Address2: Frenchs Forest; Address3: NSW; Address4: Australia 2086; DocumentNumber: 5; Revision: 1.0; SheetNumber: 5; SheetTotal: 8; SheetSize: A3
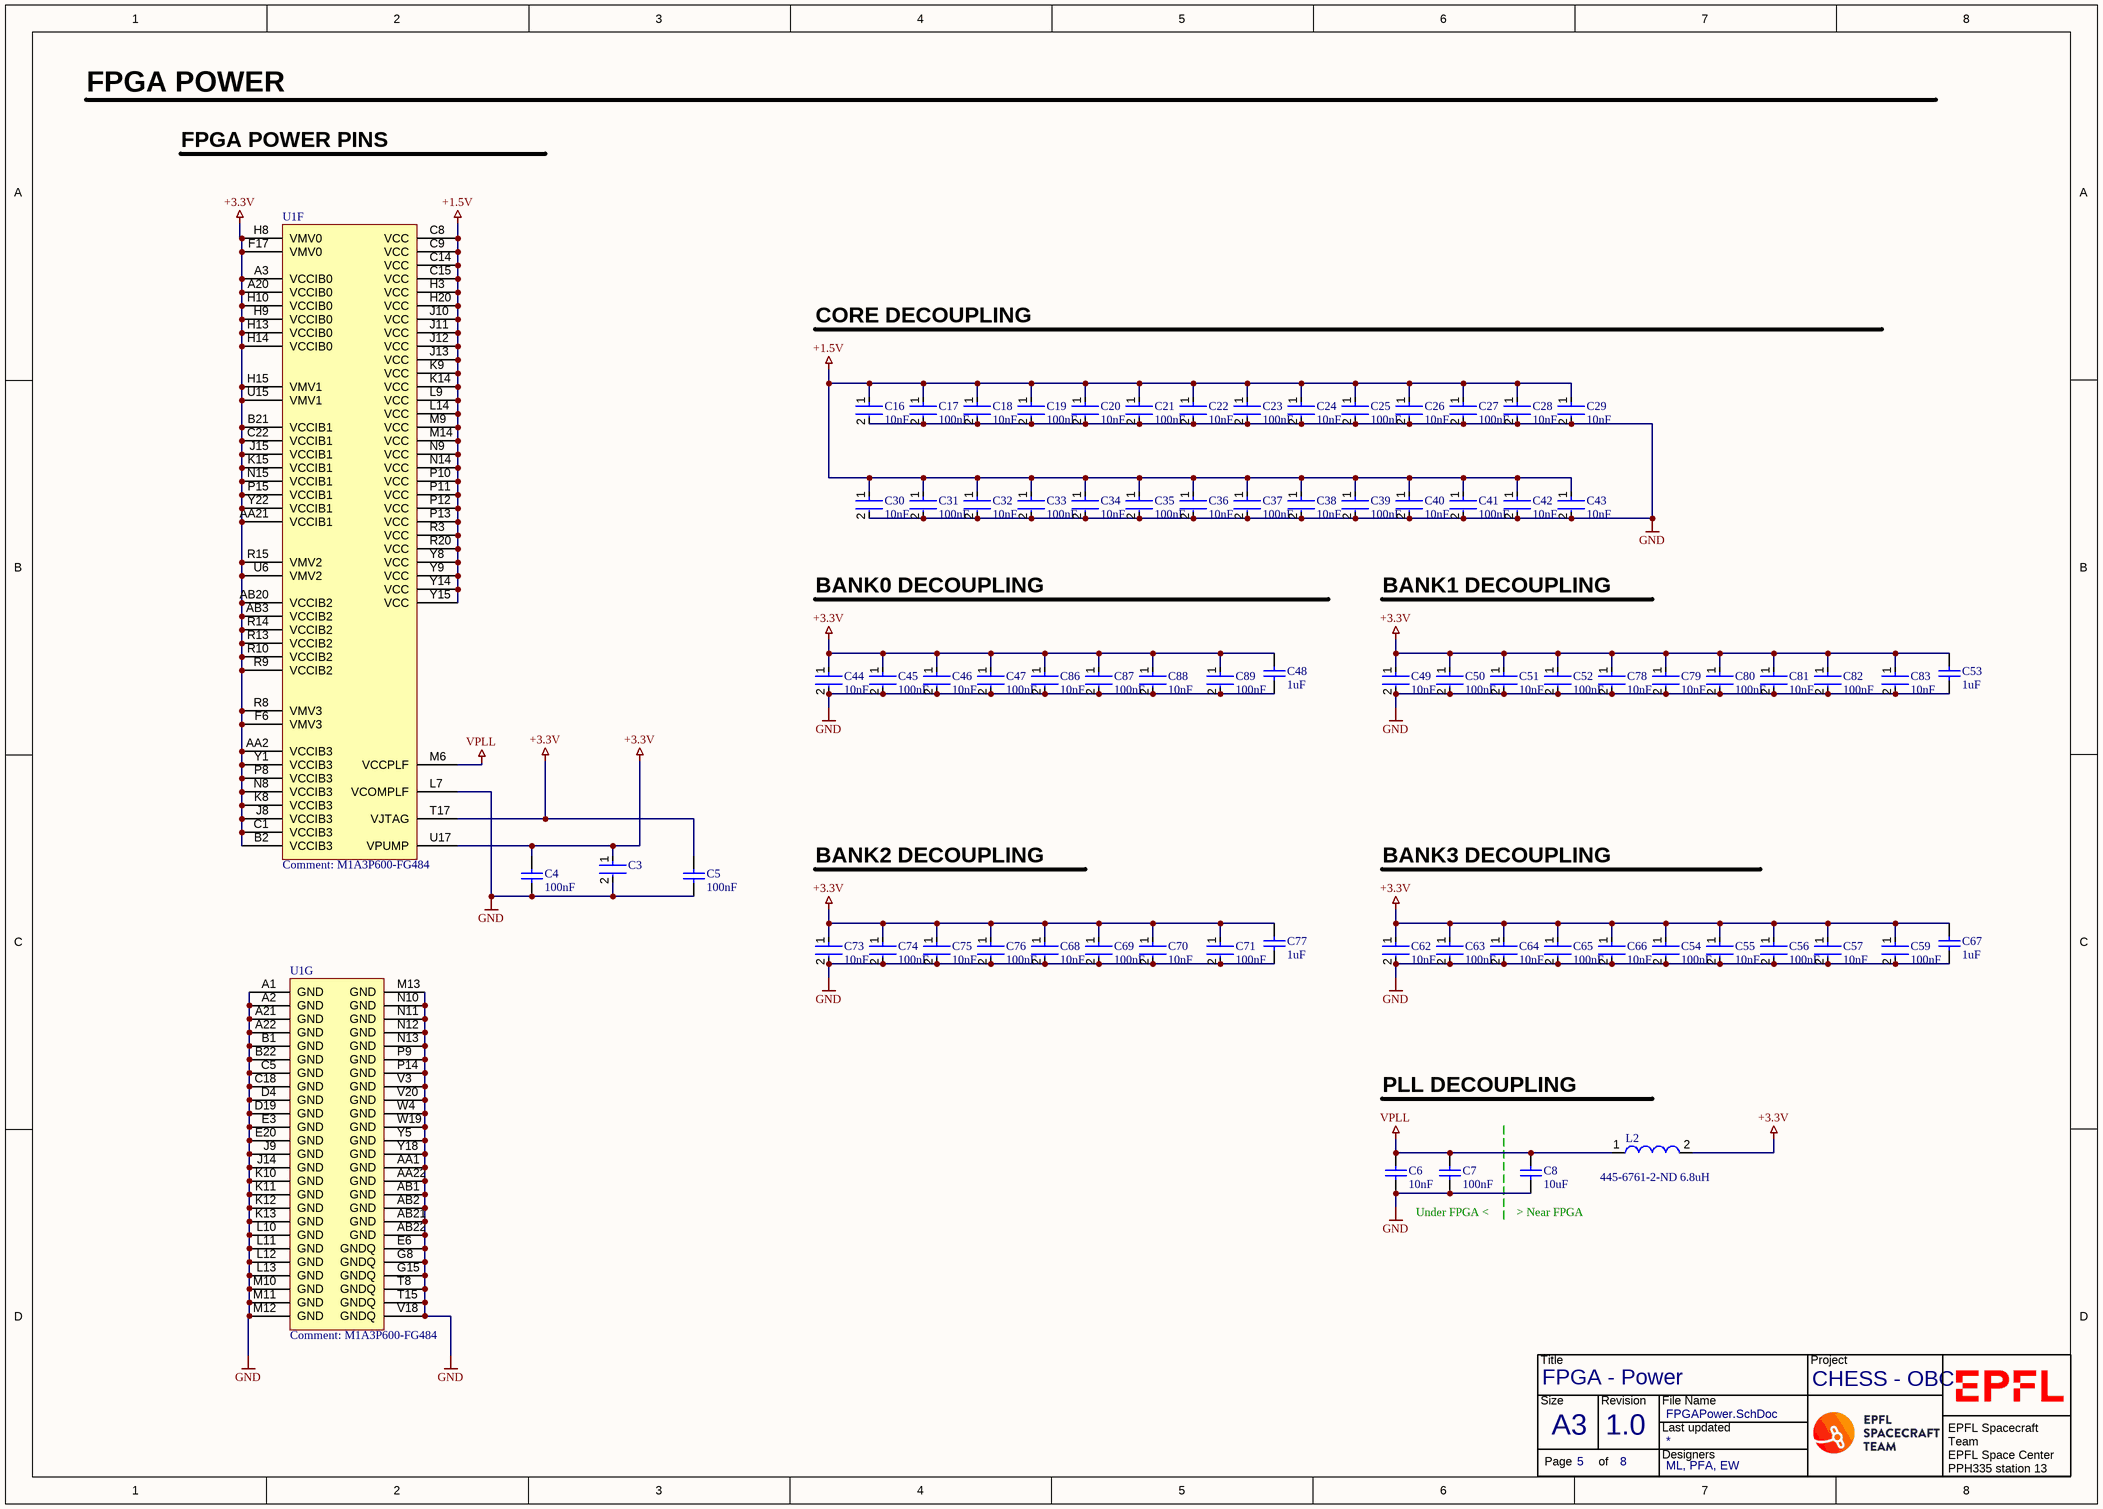
[diagram p4: FPGAPower.SchDoc]

### Parts
(Parts that share a designator on the sheet are numbered #1, #2 ... from top to bottom, then left to right.)
*#5  TitleBlock  (value not drawn)  (graphical)
C3  CC0402KRX5R6BB334  [FP-CC0402-MFG]  (value not drawn)
C4  100nF  [CAPC1005X60X30ML05T10]
C5  100nF  [CAPC1005X60X30ML05T10]
C6  10nF  [CAPC0402(1005)60_M]
C7  100nF  [CAPC1005X60X30ML05T10]
C8  10uF  [CAPC2013X145X20ML20]
C16  10nF  [FP-GRM155-0_05-IPC_C]
C17  100nF  [FP-GRM155-0_05-IPC_C]
C18  10nF  [FP-GRM155-0_05-IPC_C]
C19  100nF  [FP-GRM155-0_05-IPC_C]
C20  10nF  [FP-GRM155-0_05-IPC_C]
C21  100nF  [FP-GRM155-0_05-IPC_C]
C22  10nF  [FP-GRM155-0_05-IPC_C]
C23  100nF  [FP-GRM155-0_05-IPC_C]
C24  10nF  [FP-GRM155-0_05-IPC_C]
C25  100nF  [FP-GRM155-0_05-IPC_C]
C26  10nF  [FP-GRM155-0_05-IPC_C]
C27  100nF  [FP-GRM155-0_05-IPC_C]
C28  10nF  [FP-GRM155-0_05-IPC_C]
C29  10nF  [FP-GRM155-0_05-IPC_C]
C30  10nF  [FP-GRM155-0_05-IPC_C]
C31  100nF  [FP-GRM155-0_05-IPC_C]
C32  10nF  [FP-GRM155-0_05-IPC_C]
C33  100nF  [FP-GRM155-0_05-IPC_C]
C34  10nF  [FP-GRM155-0_05-IPC_C]
C35  100nF  [FP-GRM155-0_05-IPC_C]
C36  10nF  [FP-GRM155-0_05-IPC_C]
C37  100nF  [FP-GRM155-0_05-IPC_C]
C38  10nF  [FP-GRM155-0_05-IPC_C]
C39  100nF  [FP-GRM155-0_05-IPC_C]
C40  10nF  [FP-GRM155-0_05-IPC_C]
C41  100nF  [FP-GRM155-0_05-IPC_C]
C42  10nF  [FP-GRM155-0_05-IPC_C]
C43  10nF  [FP-GRM155-0_05-IPC_C]
C44  10nF  [FP-GRM155-0_05-IPC_C]
C45  100nF  [FP-GRM155-0_05-IPC_C]
C46  10nF  [FP-GRM155-0_05-IPC_C]
C47  100nF  [FP-GRM155-0_05-IPC_C]
C48  1uF  [CAPC1608X90X20LL10]
C49  10nF  [FP-GRM155-0_05-IPC_C]
C50  100nF  [FP-GRM155-0_05-IPC_C]
C51  10nF  [FP-GRM155-0_05-IPC_C]
C52  100nF  [FP-GRM155-0_05-IPC_C]
C53  1uF  [CAPC1608X90X20LL10]
C54  100nF  [FP-GRM155-0_05-IPC_C]
C55  10nF  [FP-GRM155-0_05-IPC_C]
C56  100nF  [FP-GRM155-0_05-IPC_C]
C57  10nF  [FP-GRM155-0_05-IPC_C]
C59  100nF  [FP-GRM155-0_05-IPC_C]
C62  10nF  [FP-GRM155-0_05-IPC_C]
C63  100nF  [FP-GRM155-0_05-IPC_C]
C64  10nF  [FP-GRM155-0_05-IPC_C]
C65  100nF  [FP-GRM155-0_05-IPC_C]
C66  10nF  [FP-GRM155-0_05-IPC_C]
C67  1uF  [CAPC1608X90X20LL10]
C68  10nF  [FP-GRM155-0_05-IPC_C]
C69  100nF  [FP-GRM155-0_05-IPC_C]
C70  10nF  [FP-GRM155-0_05-IPC_C]
C71  100nF  [FP-GRM155-0_05-IPC_C]
C73  10nF  [FP-GRM155-0_05-IPC_C]
C74  100nF  [FP-GRM155-0_05-IPC_C]
C75  10nF  [FP-GRM155-0_05-IPC_C]
C76  100nF  [FP-GRM155-0_05-IPC_C]
C77  1uF  [CAPC1608X90X20LL10]
C78  10nF  [FP-GRM155-0_05-IPC_C]
C79  10nF  [FP-GRM155-0_05-IPC_C]
C80  100nF  [FP-GRM155-0_05-IPC_C]
C81  10nF  [FP-GRM155-0_05-IPC_C]
C82  100nF  [FP-GRM155-0_05-IPC_C]
C83  10nF  [FP-GRM155-0_05-IPC_C]
C86  10nF  [FP-GRM155-0_05-IPC_C]
C87  100nF  [FP-GRM155-0_05-IPC_C]
C88  10nF  [FP-GRM155-0_05-IPC_C]
C89  100nF  [FP-GRM155-0_05-IPC_C]
L2  445-6761-2-ND 6.8uH  [SMD-0805]
U1  M1A3P600-FG484  [FG484]  (parts F,G of 8)

### Nets
+1.5V: C16.1 C17.1 C18.1 C19.1 C20.1 C21.1 C22.1 C23.1 C24.1 C25.1 C26.1 C27.1 C28.1 C29.1 C30.1 C31.1 C32.1 C33.1 C34.1 C35.1 C36.1 C37.1 C38.1 C39.1 C40.1 C41.1 C42.1 C43.1 U1.C8(VCC) U1.C9(VCC) U1.C14(VCC) U1.C15(VCC) U1.H3(VCC) U1.H20(VCC) U1.J10(VCC) U1.J11(VCC) U1.J12(VCC) U1.J13(VCC) U1.K9(VCC) U1.K14(VCC) U1.L9(VCC) U1.L14(VCC) U1.M9(VCC) U1.M14(VCC) U1.N9(VCC) U1.N14(VCC) U1.P10(VCC) U1.P11(VCC) U1.P12(VCC) U1.P13(VCC) U1.R3(VCC) U1.R20(VCC) U1.Y8(VCC) U1.Y9(VCC) U1.Y14(VCC) U1.Y15(VCC)
+3.3V: C3.1 C4.2 C5.2 C44.1 C45.1 C46.1 C47.1 C48.2 C49.1 C50.1 C51.1 C52.1 C53.2 C54.1 C55.1 C56.1 C57.1 C59.1 C62.1 C63.1 C64.1 C65.1 C66.1 C67.2 C68.1 C69.1 C70.1 C71.1 C73.1 C74.1 C75.1 C76.1 C77.2 C78.1 C79.1 C80.1 C81.1 C82.1 C83.1 C86.1 C87.1 C88.1 C89.1 L2.2 U1.A3(VCCIB0) U1.A20(VCCIB0) U1.AA2(VCCIB3) U1.AA21(VCCIB1) U1.AB3(VCCIB2) U1.AB20(VCCIB2) U1.B2(VCCIB3) U1.B21(VCCIB1) U1.C1(VCCIB3) U1.C22(VCCIB1) U1.F6(VMV3) U1.F17(VMV0) U1.H8(VMV0) U1.H9(VCCIB0) U1.H10(VCCIB0) U1.H13(VCCIB0) U1.H14(VCCIB0) U1.H15(VMV1) U1.J8(VCCIB3) U1.J15(VCCIB1) U1.K8(VCCIB3) U1.K15(VCCIB1) U1.N8(VCCIB3) U1.N15(VCCIB1) U1.P8(VCCIB3) U1.P15(VCCIB1) U1.R8(VMV3) U1.R9(VCCIB2) U1.R10(VCCIB2) U1.R13(VCCIB2) U1.R14(VCCIB2) U1.R15(VMV2) U1.T17(VJTAG) U1.U6(VMV2) U1.U15(VMV1) U1.U17(VPUMP) U1.Y1(VCCIB3) U1.Y22(VCCIB1)
GND: C3.2 C4.1 C5.1 C6.1 C7.1 C8.1 C16.2 C17.2 C18.2 C19.2 C20.2 C21.2 C22.2 C23.2 C24.2 C25.2 C26.2 C27.2 C28.2 C29.2 C30.2 C31.2 C32.2 C33.2 C34.2 C35.2 C36.2 C37.2 C38.2 C39.2 C40.2 C41.2 C42.2 C43.2 C44.2 C45.2 C46.2 C47.2 C48.1 C49.2 C50.2 C51.2 C52.2 C53.1 C54.2 C55.2 C56.2 C57.2 C59.2 C62.2 C63.2 C64.2 C65.2 C66.2 C67.1 C68.2 C69.2 C70.2 C71.2 C73.2 C74.2 C75.2 C76.2 C77.1 C78.2 C79.2 C80.2 C81.2 C82.2 C83.2 C86.2 C87.2 C88.2 C89.2 U1.A1(GND) U1.A2(GND) U1.A21(GND) U1.A22(GND) U1.AA1(GND) U1.AA22(GND) U1.AB1(GND) U1.AB2(GND) U1.AB21(GND) U1.AB22(GND) U1.B1(GND) U1.B22(GND) U1.C5(GND) U1.C18(GND) U1.D4(GND) U1.D19(GND) U1.E3(GND) U1.E6(GNDQ) U1.E20(GND) U1.G8(GNDQ) U1.G15(GNDQ) U1.J9(GND) U1.J14(GND) U1.K10(GND) U1.K11(GND) U1.K12(GND) U1.K13(GND) U1.L7(VCOMPLF) U1.L10(GND) U1.L11(GND) U1.L12(GND) U1.L13(GND) U1.M10(GND) U1.M11(GND) U1.M12(GND) U1.M13(GND) U1.N10(GND) U1.N11(GND) U1.N12(GND) U1.N13(GND) U1.P9(GND) U1.P14(GND) U1.T8(GNDQ) U1.T15(GNDQ) U1.V3(GND) U1.V18(GNDQ) U1.V20(GND) U1.W4(GND) U1.W19(GND) U1.Y5(GND) U1.Y18(GND)
VPLL: C6.2 C7.2 C8.2 L2.1 U1.M6(VCCPLF)

### Notes on the sheet
- FPGA POWER
- FPGA POWER PINS
- CORE DECOUPLING
- BANK0 DECOUPLING
- BANK1 DECOUPLING
- BANK2 DECOUPLING
- BANK3 DECOUPLING
- PLL DECOUPLING
- Under FPGA <
- (near C8) > Near FPGA
- 8
- 7
- 6
- 5
- 4
- 3
- DWG. NO.
- REV.
- SHT.
- REVISION
- 2
- DESCRIPTION
- DATE
- 1
- APPROVED
- THIS DOCUMENT AND THE DATA DISCLOSED HEREIN OR HEREWITH IS THE PROPERTY OF ALTIUM LIMITED AND MAY BE FREELY DISTRIBUTED IN WHOLE. NO RIGHTS ARE RESERVED OR EXPRESS OR IMPLIED WARANTEE GIVEN.
- F
- E
- D
- C
- B
- A
- SCALE:
- A3
- SIZE
- CAGE CODE
- FILE NAME
- DWG NO.
- SHEET
- OF
- REV
- (in symbol TitleBlock) Title; Project; Size; Revision; File Name; Last updated; Designers; Page; of; EPFL Spacecraft Team / EPFL Space Center / PPH335 station 13 / CH-1015 Lausanne

### Library data of the parts
*#5 = TitleBlock: Title Block with generall information
C3 = CMP-03422-001340-1: CAP CER 0.33UF 10V X5R 0402; Manufacturer: YAGEO; Automotive Grade: NA; Value: 330 nF; Temperature Coefficient: 30ppm/°C; Material: Ceramic; Tolerance: 0.1; ComponentLink2URL: http://www.yageo.com/documents/recent/UPY-GP_NP0_16V-to-50V_16.pdf; Device Class L2: Capacitors; Voltage Rating: 10 V; ComponentLink2Description: Datasheet; Package: CC0402; Device Class L3: Ceramic Capacitors; Digikey Description: CAP CER 0.33UF 10V X5R 0402; Device Class L1: Passive Components; Footprint Url: http://www.yageo.com/exep/pages/download/literatures/UPY-C_GEN_24.pdf; Temperature Characteristic: X5R; Octopart: https://octopart.com/cc0402krx5r6bb334-yageo-21548561; Automotive: No; Temperature: -55°C to +125°C; Lead Free: Yes; Temperature Range Low: -55°C; Height: 0.55mm; Ipc Land Pattern Name: CAPC10050X50; Category: Cap; Capacitance: 330 nF; Manufacturer Part Number: CC0402KRX5R6BB334; RoHS: TRUE; Mouser Description: 0402 330 nF 10 V ±10 % Tolerance X5R SMT Multilayer Ceramic Capacitor; Temperature Range High: +125°C
C4 C5 C7 = CMP-2008-02046-1: as C10 on sheet Memory
C6 = CMP-1034-01878-1: CAP 10nF 16V -20% to +80% 0402 (1005 Metric) Thickness 0.6mm SMD; Case-Metric: 1005; Case-EIA: 0402; Rated Voltage: 16 V; Max Thickness: 0.6 mm; Tolerance: -20% to +80%; Value: 10nF; Technology: SMT
C8 = CMP-2000-05452-1: Multilayer Ceramic Chip Capacitor, 10 uF, +/- 10%, 10 V, -55 to 125 degC, 0805 (2012 Metric), RoHS, Tape and Reel; Manufacturer: TDK; PCN Part Number: MLCCPartNumberChange30/Nov/2012; Capacitance: 10µF; Voltage - Rated: 10V; Product Training Modules: CSeriesGeneralApplicationsSEAT,CCV,andTVCLDesignToolsGuidetoReplacinganElectrolyticCapacitorwithanMLCC; Online Catalog: CSeries,GeneralPurpose; Other Names: 445-6857-6; Temperature Coefficient: X7R; Features: -; Ratings: -; Operating Temperature: -55degC~125degC; RoHS Information: RoHSCertificate-MLCC; Datasheet Version: Mar-15; Package / Case: 0805(2012Metric); Series: C; Mounting Type: SurfaceMount,MLCC; Family: CeramicCapacitors; Height - Seated (Max): -; Manufacturer URL: http://www.tdk.com/; Packaging: Digi-Reel; Tolerance: ±10%; Category: Capacitors; Applications: GeneralPurpose; Standard Package: 1; Size / Dimension: 0.079"Lx0.049"W(2.00mmx1.25mm); Datasheet URL: http://download.siliconexpert.com/pdfs/2015/4/21/15/54/45/779/tdk_/manual/37024850441143360mlcc_commercial_general_en.pdf; Lead Style: -; Lead Spacing: -; Thickness (Max): 0.057"(1.45mm); Package Reference: 805; Package Description: 2-Pin Surface Mount Device, Body 2 x 1.25 mm
C16 C18 C20 C22 C24 C26 C28-C30 C32 C34 C36 C38 C40 C42-C44 C46 C49 C51 C55 C57 C62 C64 C66 C68 C70 C73 C75 C78 C79 C81 C83 C86 C88 = CMP-2008-04637-5: Chip Multilayer Ceramic Capacitors for General Purpose, 0402, 10000pF, X7R, 15%, 10%, 50V GRM155R71H103KA88D; Voltage: 25V; Tolerance: 10%; Mount: Surface Mount; Lead Free: Lead Free; Radiation Hardening: No; Case Code (Imperial): 0402; REACH SVHC: No SVHC; Case/Package: 0402; Dielectric: X7R; Voltage Rating (DC): 50V; Max Operating Temperature: 125°C; Termination: SMD/SMT; Material: Ceramic; Width: 0.02inch; Package Quantity: 1; Voltage Rating: 50V; Thickness: 0.022inch; Packaging: Tape and Reel; Height: 0.5mm; Number of Pins: 2; Case Code (Metric): 1005; Min Operating Temperature: -55°C; Length: 1mm; Capacitance: 10nF; Depth: 0.5mm
C17 C19 C21 C23 C25 C27 C31 C33 C35 C37 C39 C41 C45 C47 C50 C52 C54 C56 C59 C63 C65 C69 C71 C74 C76 C80 C82 C87 C89 = CMP-2008-04637-5: Chip Multilayer Ceramic Capacitors for General Purpose, 0402, 10000pF, X7R, 15%, 10%, 50V GRM155R71H103KA88D; Voltage: 25V; Capacitance: 10nF; Tolerance: 10%; Mount: Surface Mount; Lead Free: Lead Free; Radiation Hardening: No; Case Code (Imperial): 0402; REACH SVHC: No SVHC; Case/Package: 0402; Dielectric: X7R; Voltage Rating (DC): 50V; Max Operating Temperature: 125°C; Termination: SMD/SMT; Material: Ceramic; Width: 0.02inch; Package Quantity: 1; Voltage Rating: 50V; Thickness: 0.022inch; Packaging: Tape and Reel; Height: 0.5mm; Number of Pins: 2; Case Code (Metric): 1005; Min Operating Temperature: -55°C; Length: 1mm; Depth: 0.5mm
C48 C53 C67 C77 = CMP-2000-06025-1: Chip Capacitor, 1 uF, +/- 10%, 50 V, -55 to 85 degC, 0603 (1608 Metric), RoHS, Tape and Reel; Manufacturer: TDK; PCN Part Number: MLCCPartNumberChange30/Nov/2012; Other Names: 445-7468-6; Online Catalog: CSeries,GeneralPurpose; Capacitance: 1µF; Product Training Modules: CSeriesGeneralApplicationsSEAT,CCV,andTVCLDesignToolsGuidetoReplacinganElectrolyticCapacitorwithanMLCC; Voltage - Rated: 50V; Design Resources: 20WNon-IsolatedBuckLEDDriverUsingPLLNK460KG; Temperature Coefficient: X5R; Series: C; Datasheet Version: 08/2016; Package Description: 2-Pin Surface Mount Device, Body 1.6 x 0.8 mm; Mounting Technology: SurfaceMount; Features: -; Size / Dimension: 0.063"Lx0.031"W(1.60mmx0.80mm); Lead Spacing: -; Operating Temperature: -55°C~85°C; Tolerance: ±10%; Height - Seated (Max): -; Mounting Type: SurfaceMount,MLCC; Ratings: -; Standard Package: 1; Applications: GeneralPurpose; Datasheet URL: https://product.tdk.com/info/en/catalog/datasheets/mlcc_commercial_general_en.pdf; Category: Capacitors; Lead Style: -; Packaging: Digi-Reel®; RoHS Information: RoHSCertificate-MLCC; Package / Case: 0603(1608Metric); Package Reference: 0603; Manufacturer URL: http://www.tdk.com/; Thickness (Max): 0.035"(0.90mm); Family: CeramicCapacitors
L2 = CMP-0221-00012-1: SMD-Multilayer Inductor WE-MI, L = 1.00 µH; Inductance: 1.00 ÂµH; ComponentLink2URL: http://www.we-online.de/katalog/media/pdf/7447905.pdf; ComponentLink1Description: Manufacturer Link; ComponentLink2Description: Datasheet; DatasheetVersion: ver 4, Oct-2004; PackageVersion: 2005; PackageReference: SMD-0805; ComponentLink1URL: http://www.we-online.com; PackageDescription: Chip Inductor, 2-Leads, Body 2.0 x 1.2 mm
U1 = CMP-0097-00007-1: M1-Ready ProASIC3 Flash Family FPGA, 235 User IOs, 600K System Gates, 108 Kbits RAM, 1 Kbit Flash ROM, 1 PLL, 484-Ball FBGA, Commercial Grade; Code_JEDEC: MS-034-AAJ-1; PackageDescription: 484-Ball Fine Pitch Plastic Ball Grid Array (FG484) - Fully Populated; DatasheetVersion: v1.3, Oct-2009; PackageReference: FG484; PackageVersion: ver11.2, Nov-2009; Code_IPC: BGA100P22X22-484